# EAGLE board max10adc_v9.0_16chan_frontendtest2 (EAGLE 9.5.2), part 1 of 3
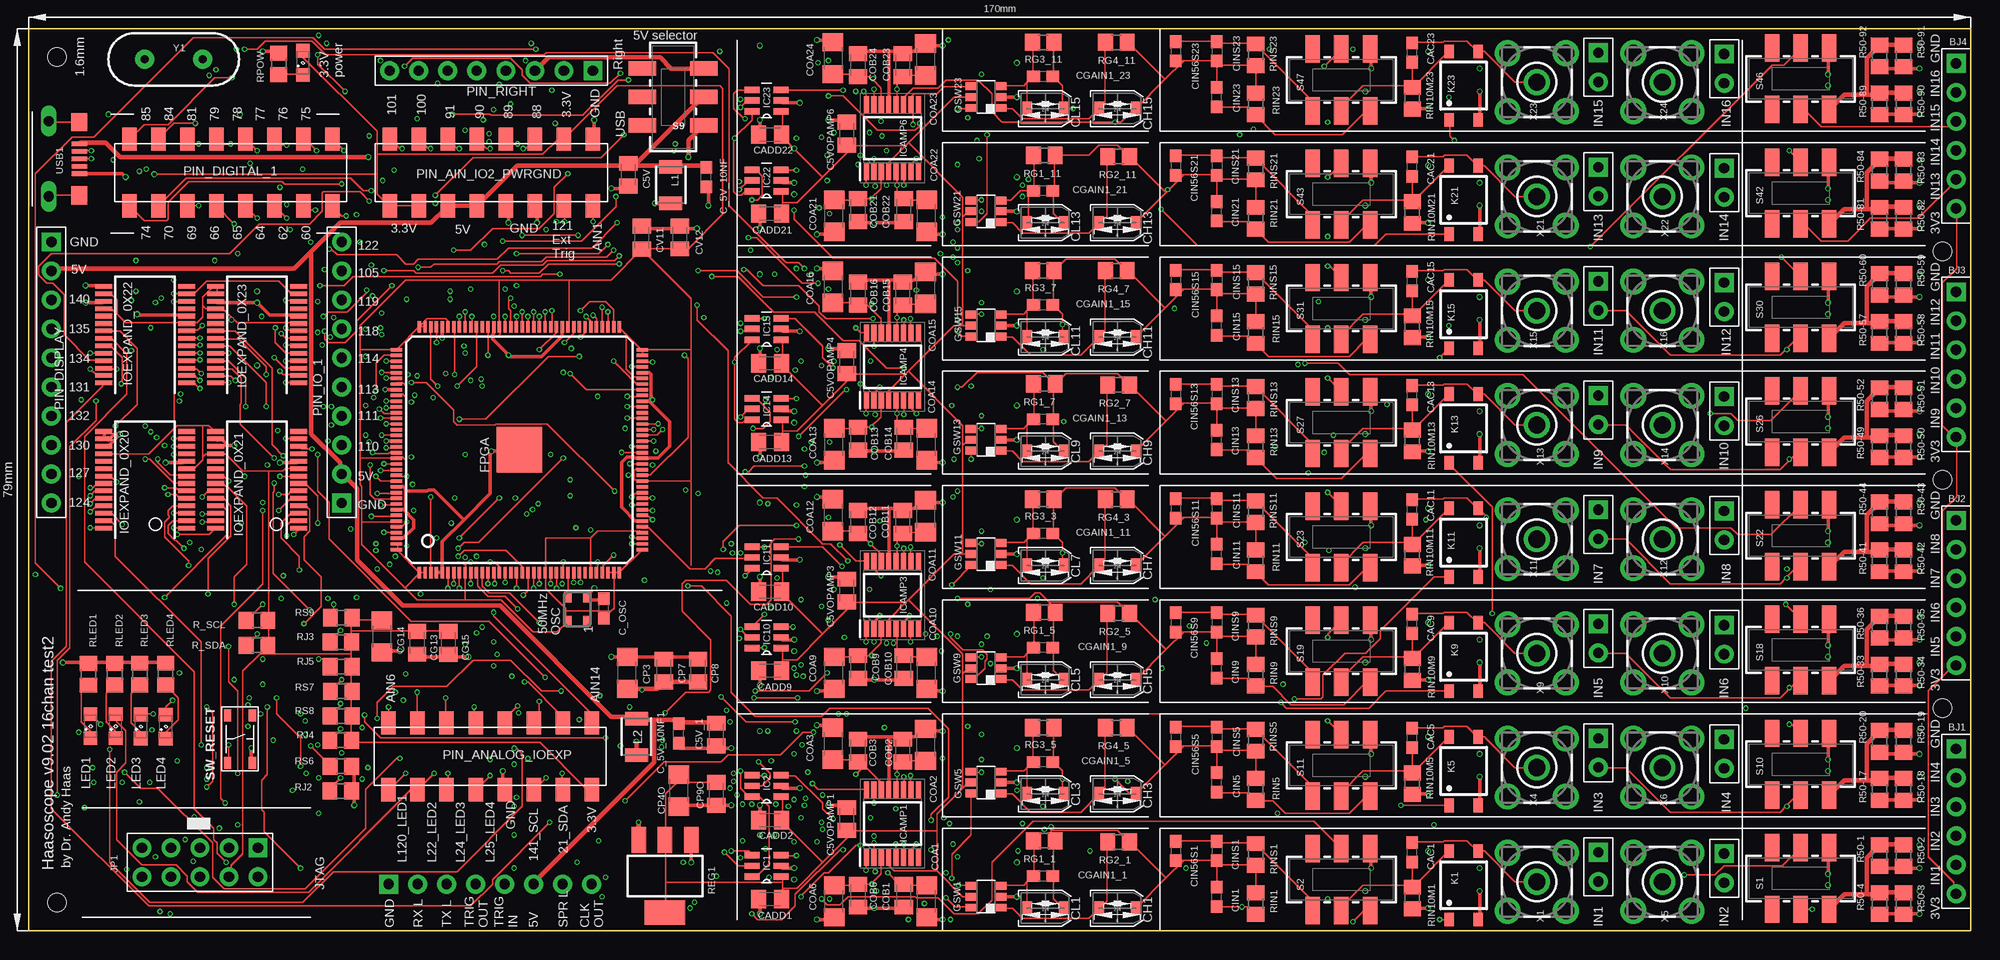
[diagram p6: board, top side]
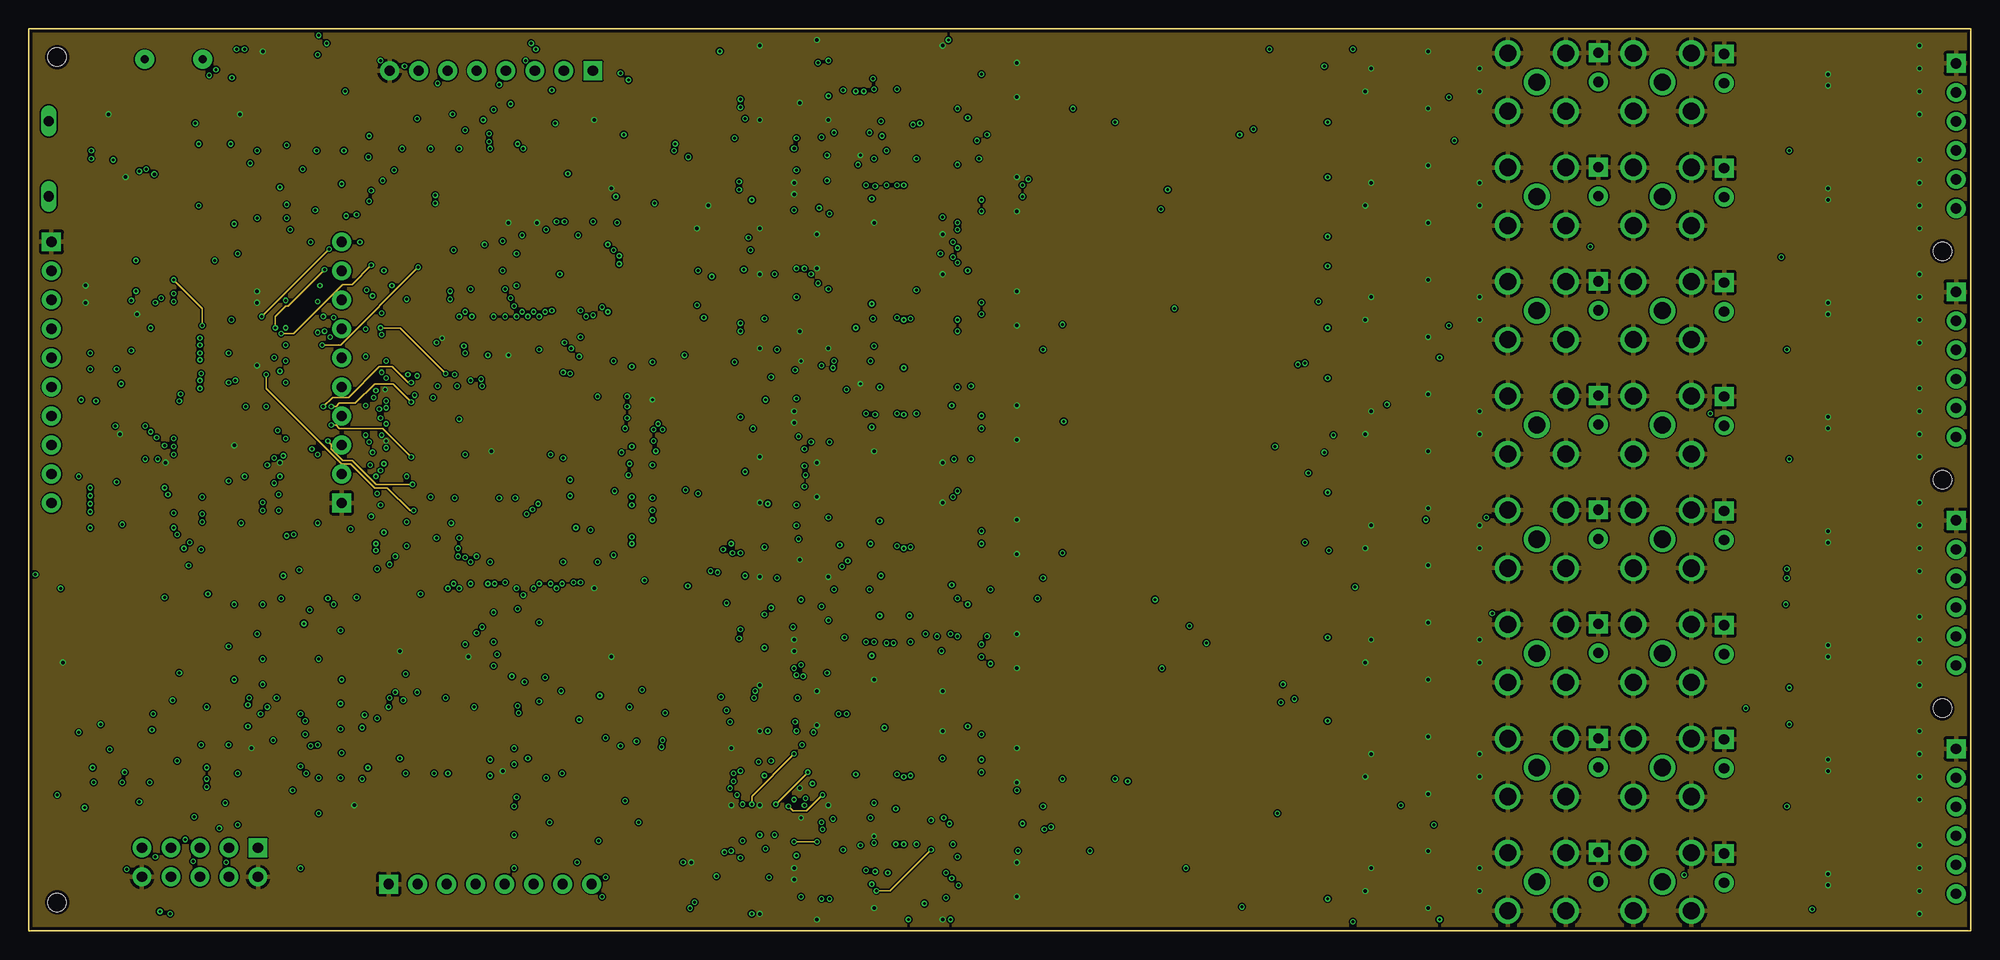
[diagram p7: board, inner layer Route2]
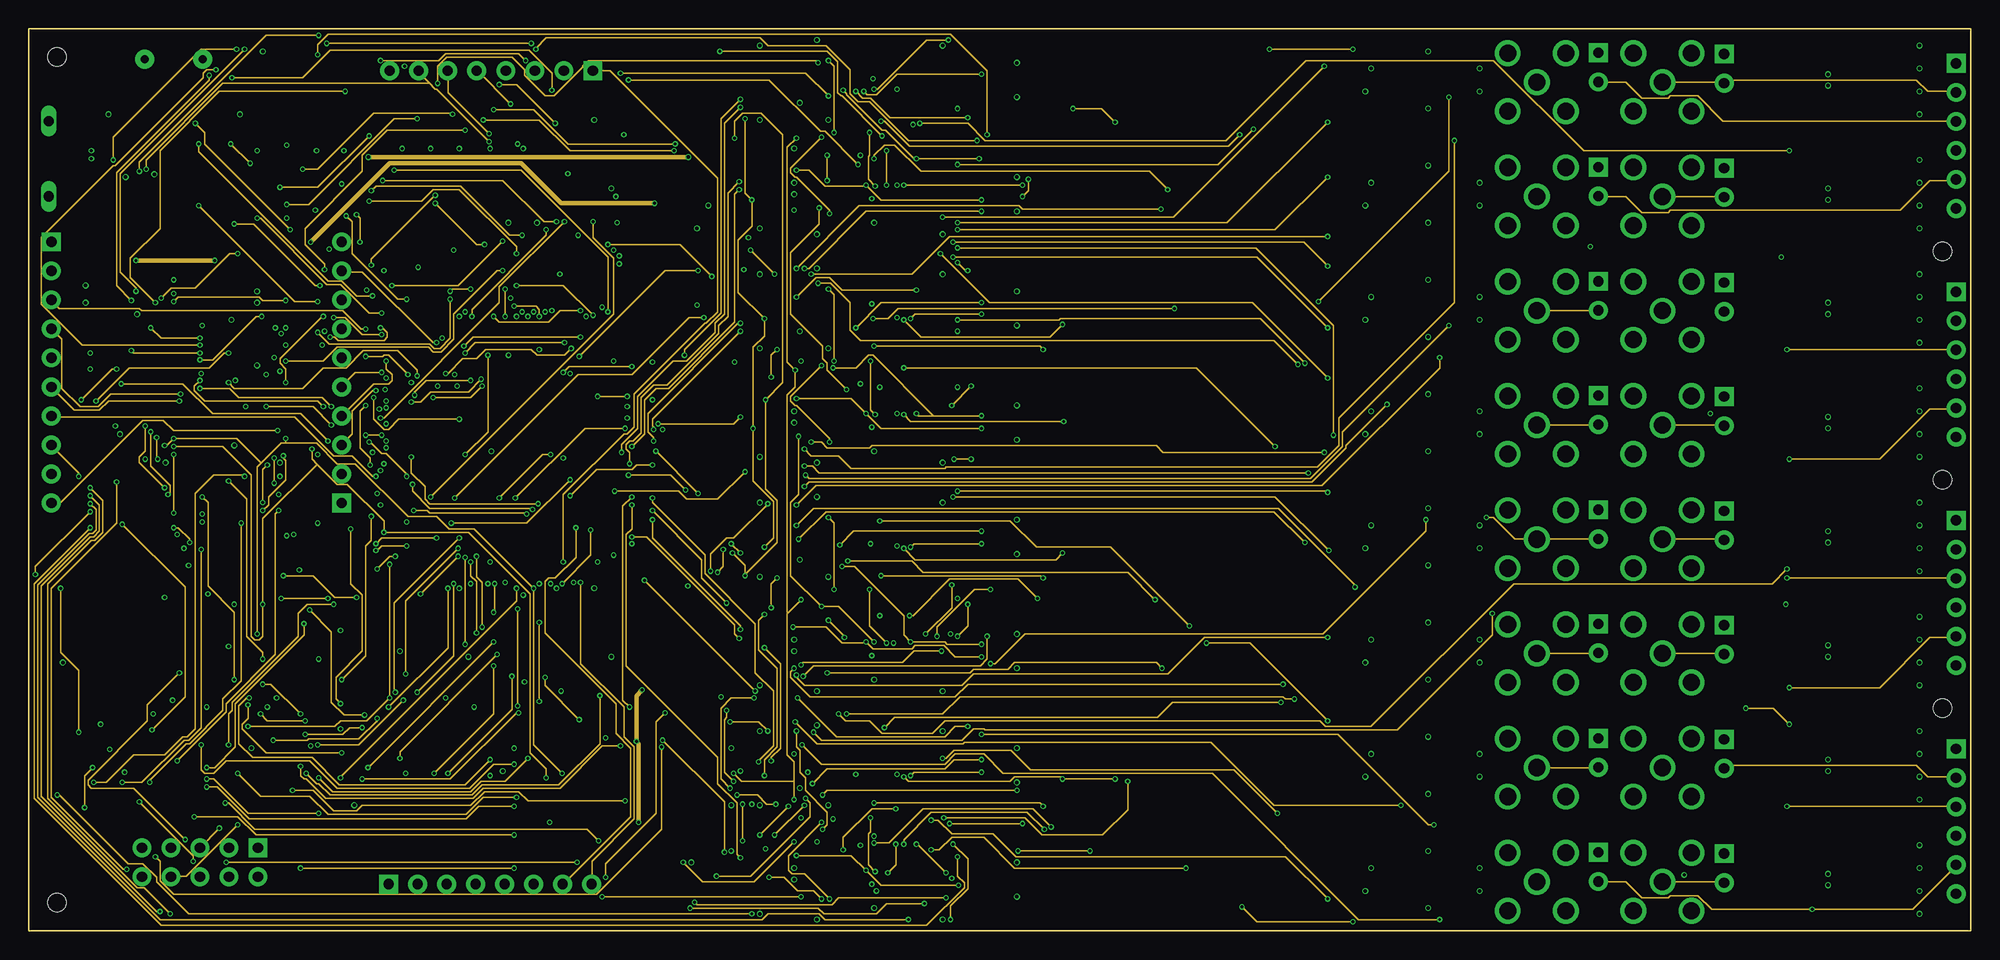
[diagram p8: board, inner layer Route15]
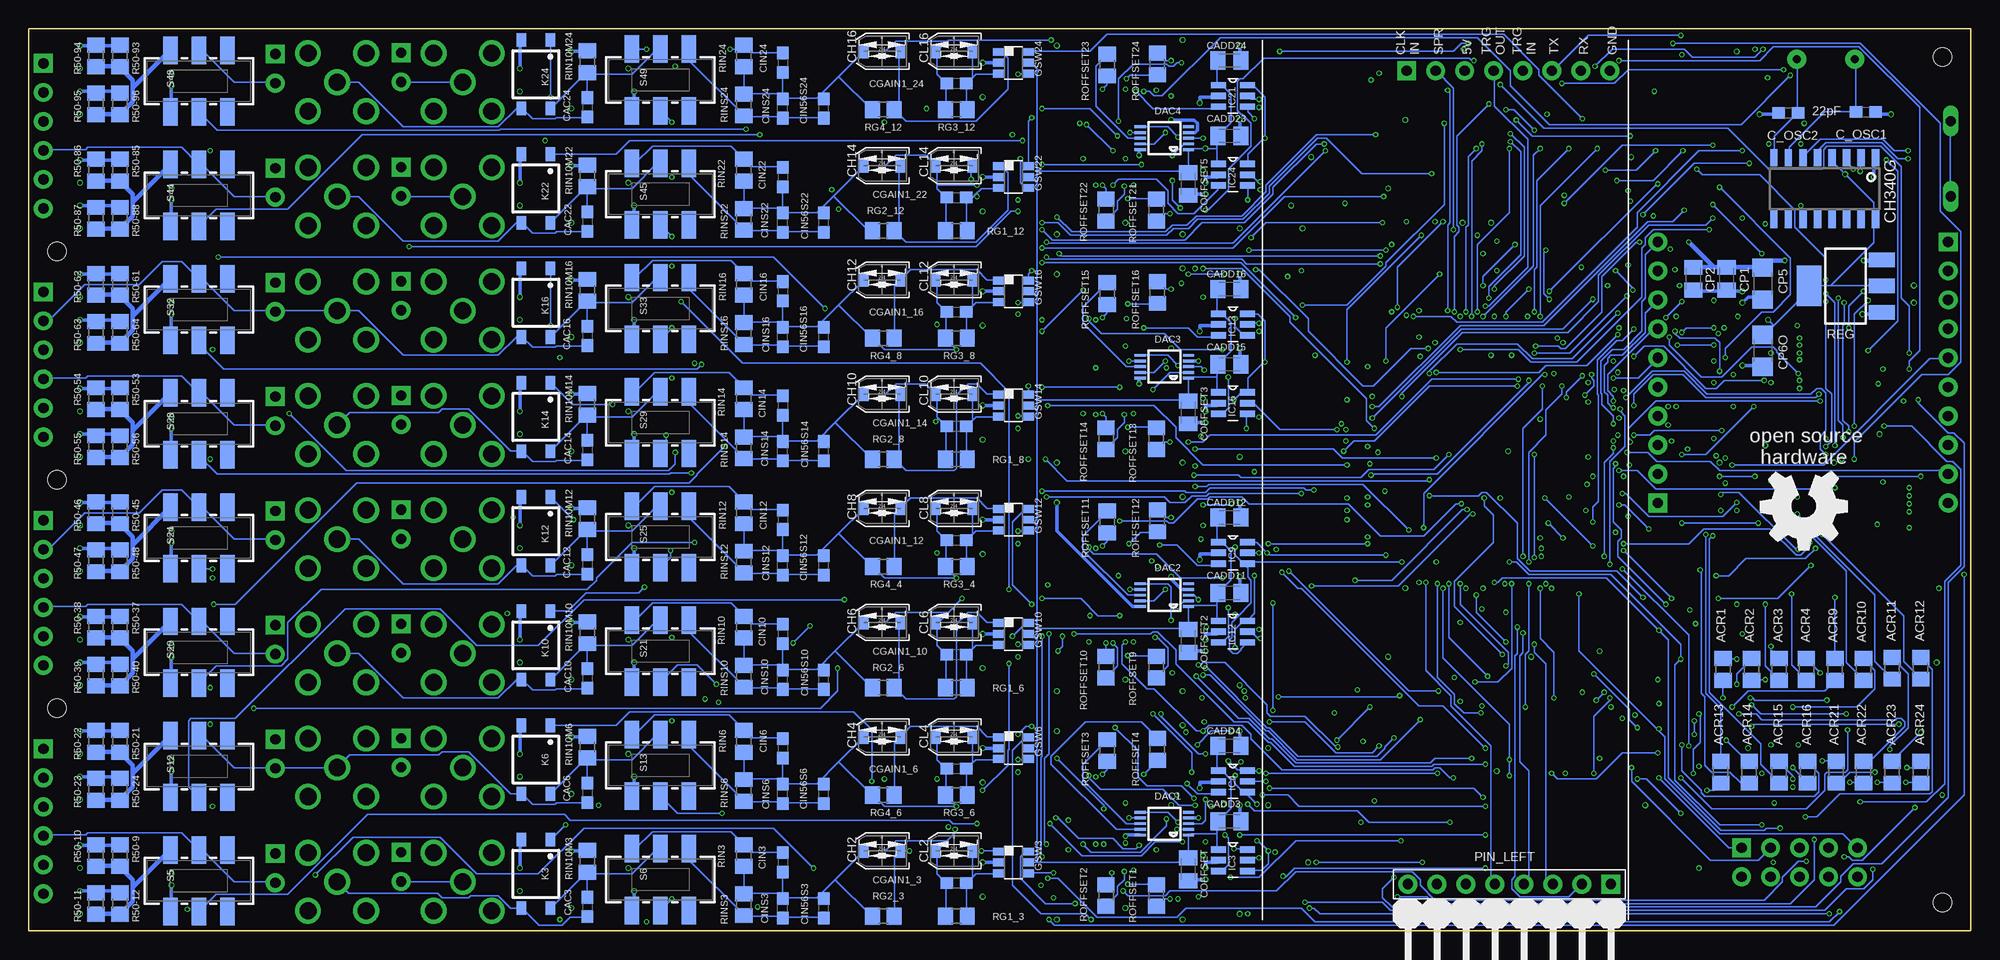
[diagram p9: board, bottom side, seen from below]

Size 170 x 79 mm. Coordinates in mm from the lower left corner, seen from the top.
Outline: 0,0 0,79 170,79 170,0 0,0
Copper layers (1*2*15*16): Top 0.035mm / dielectric 0.23mm / Route2 0.035mm / dielectric 0.93mm / Route15 0.035mm / dielectric 0.23mm / Bottom 0.035mm
Design rules "MF_Standard_4_Layer": minimum track width 5mil, minimum drill 10mil, track to track 5mil, track to pad 5mil, pad to pad 5mil, via to via 5mil, smd to smd 0mil, copper to edge 10mil, drill to drill 10mil, minimum pad ring 4mil, minimum via ring 4mil, stop-mask expansion 2mil, vias tented up to drill 25mil, thermal gap 10mil
Net classes: 0 default: width 0.152 mm; 1 gnd: width 0.305 mm; 2 three: width 0.152 mm; 3 five: width 0.381 mm
Holes 1.6 mm at 2.5,76.5 2.5,2.5 167.5,19.5 167.5,59.5 167.5,39.5

## Footprints (pad centres in the part's own frame; a part is rotated, then mirrored left to right if it is on the bottom)
R0805 = smd 1.3 x 1.5: 1 -0.95,0; 2 0.95,0
H6-2.54 = drill 0.889 pad 1.651 square: 1 0,6.35 | drill 0.889 pad 1.651: 2 0,3.81; 3 0,1.27; 4 0,-1.27; 5 0,-3.81; 6 0,-6.35
C0805K = smd 1.3 x 1.6: 1 -1,0; 2 1,0
C0603 = smd 1.1 x 1: 1 -0.85,0; 2 0.85,0
C1206 = smd 1.6 x 1.8: 1 -1.4,0; 2 1.4,0
CTZ3 = smd 1.2 x 0.8: + 0,1.598; - 0,-1.588
MSOP10 = smd 0.25 x 1: 1 -1,-2.113; 2 -0.5,-2.113; 3 0,-2.113; 4 0.5,-2.113; 5 1,-2.113; 6 1,2.113; 7 0.5,2.113; 8 0,2.113; 9 -0.5,2.113; 10 -1,2.113
EQFP144 = smd 1 x 0.3: 1 -10.75,8.75; 2 -10.75,8.25; 3 -10.75,7.75; 4 -10.75,7.25; 5 -10.75,6.75; 6 -10.75,6.25; 7 -10.75,5.75; 8 -10.75,5.25; 9 -10.75,4.75; 10 -10.75,4.25; 11 -10.75,3.75; 12 -10.75,3.25; 13 -10.75,2.75; 14 -10.75,2.25; 15 -10.75,1.75; 16 -10.75,1.25; 17 -10.75,0.75; 18 -10.75,0.25; 19 -10.75,-0.25; 20 -10.75,-0.75; 21 -10.75,-1.25; 22 -10.75,-1.75; 23 -10.75,-2.25; 24 -10.75,-2.75; 25 -10.75,-3.25; 26 -10.75,-3.75; 27 -10.75,-4.25; 28 -10.75,-4.75; 29 -10.75,-5.25; 30 -10.75,-5.75; 31 -10.75,-6.25; 32 -10.75,-6.75; 33 -10.75,-7.25; 34 -10.75,-7.75; 35 -10.75,-8.25; 36 -10.75,-8.75; 73 10.75,-8.75; 74 10.75,-8.25; 75 10.75,-7.75; 76 10.75,-7.25; 77 10.75,-6.75; 78 10.75,-6.25; 79 10.75,-5.75; 80 10.75,-5.25; 81 10.75,-4.75; 82 10.75,-4.25; 83 10.75,-3.75; 84 10.75,-3.25; 85 10.75,-2.75; 86 10.75,-2.25; 87 10.75,-1.75; 88 10.75,-1.25; 89 10.75,-0.75; 90 10.75,-0.25; 91 10.75,0.25; 92 10.75,0.75; 93 10.75,1.25; 94 10.75,1.75; 95 10.75,2.25; 96 10.75,2.75; 97 10.75,3.25; 98 10.75,3.75; 99 10.75,4.25; 100 10.75,4.75; 101 10.75,5.25; 102 10.75,5.75; 103 10.75,6.25; 104 10.75,6.75; 105 10.75,7.25; 106 10.75,7.75; 107 10.75,8.25; 108 10.75,8.75 | smd 0.3 x 1: 37 -8.75,-10.75; 38 -8.25,-10.75; 39 -7.75,-10.75; 40 -7.25,-10.75; 41 -6.75,-10.75; 42 -6.25,-10.75; 43 -5.75,-10.75; 44 -5.25,-10.75; 45 -4.75,-10.75; 46 -4.25,-10.75; 47 -3.75,-10.75; 48 -3.25,-10.75; 49 -2.75,-10.75; 50 -2.25,-10.75; 51 -1.75,-10.75; 52 -1.25,-10.75; 53 -0.75,-10.75; 54 -0.25,-10.75; 55 0.25,-10.75; 56 0.75,-10.75; 57 1.25,-10.75; 58 1.75,-10.75; 59 2.25,-10.75; 60 2.75,-10.75; 61 3.25,-10.75; 62 3.75,-10.75; 63 4.25,-10.75; 64 4.75,-10.75; 65 5.25,-10.75; 66 5.75,-10.75; 67 6.25,-10.75; 68 6.75,-10.75; 69 7.25,-10.75; 70 7.75,-10.75; 71 8.25,-10.75; 72 8.75,-10.75; 109 8.75,10.75; 110 8.25,10.75; 111 7.75,10.75; 112 7.25,10.75; 113 6.75,10.75; 114 6.25,10.75; 115 5.75,10.75; 116 5.25,10.75; 117 4.75,10.75; 118 4.25,10.75; 119 3.75,10.75; 120 3.25,10.75; 121 2.75,10.75; 122 2.25,10.75; 123 1.75,10.75; 124 1.25,10.75; 125 0.75,10.75; 126 0.25,10.75; 127 -0.25,10.75; 128 -0.75,10.75; 129 -1.25,10.75; 130 -1.75,10.75; 131 -2.25,10.75; 132 -2.75,10.75; 133 -3.25,10.75; 134 -3.75,10.75; 135 -4.25,10.75; 136 -4.75,10.75; 137 -5.25,10.75; 138 -5.75,10.75; 139 -6.25,10.75; 140 -6.75,10.75; 141 -7.25,10.75; 142 -7.75,10.75; 143 -8.25,10.75; 144 -8.75,10.75 | smd 4 x 4: E 0,0
DBV_R-PDSO-G6 = smd 0.69 x 0.99: 1 -0.95,-1.29; 2 0,-1.29; 3 0.95,-1.29; 4 0.95,1.3; 5 0,1.3; 6 -0.95,1.3
SOT95P280X145-6N = smd 1.321 x 0.559: 1 -1.27,0.94; 2 -1.27,0; 3 -1.27,-0.94; 4 1.27,-0.94; 5 1.27,0; 6 1.27,0.94
SOP65P640X120-16N = smd 1.475 x 0.45: 1 -2.938,2.275; 2 -2.938,1.625; 3 -2.938,0.975; 4 -2.938,0.325; 5 -2.938,-0.325; 6 -2.938,-0.975; 7 -2.938,-1.625; 8 -2.938,-2.275; 9 2.938,-2.275; 10 2.938,-1.625; 11 2.938,-0.975; 12 2.938,-0.325; 13 2.938,0.325; 14 2.938,0.975; 15 2.938,1.625; 16 2.938,2.275
H2-2.54 = drill 0.889 pad 1.651 square: 1 0,1.27 | drill 0.889 pad 1.651: 2 0,-1.27
SSOP28 = smd 0.4 x 1.5: 1 -4.225,-3.625; 2 -3.575,-3.625; 3 -2.925,-3.625; 4 -2.275,-3.625; 5 -1.625,-3.625; 6 -0.975,-3.625; 7 -0.325,-3.625; 8 0.325,-3.625; 9 0.975,-3.625; 10 1.625,-3.625; 11 2.275,-3.625; 12 2.925,-3.625; 13 3.575,-3.625; 14 4.225,-3.625; 15 4.225,3.625; 16 3.575,3.625; 17 2.925,3.625; 18 2.275,3.625; 19 1.625,3.625; 20 0.975,3.625; 21 0.325,3.625; 22 -0.325,3.625; 23 -0.975,3.625; 24 -1.625,3.625; 25 -2.275,3.625; 26 -2.925,3.625; 27 -3.575,3.625; 28 -4.225,3.625
H2X5-2.54 = drill 0.889 pad 1.651 square: 1 -1.27,5.08 | drill 0.889 pad 1.651: 2 -1.27,2.54; 3 -1.27,0; 4 -1.27,-2.54; 5 -1.27,-5.08; 6 1.27,-5.08; 7 1.27,-2.54; 8 1.27,0; 9 1.27,2.54; 10 1.27,5.08
SOP04 = smd 0.8 x 1.2: 1 -1.27,-3; 2 1.27,-3; 3 1.27,3; 4 -1.27,3
1210 = smd 1.2 x 2: 1 -1.6,0; 2 1.6,0
SML0805 = smd 1.2 x 1.2: A 1.05,0; C -1.05,0
ASE = smd 0.9 x 0.65: 1 -1.05,-0.825; 2 1.05,-0.825; 3 1.05,0.825; 4 -1.05,0.825
2X08_SMT = smd 1.27 x 2.032: 1 -8.89,-2.921; 2 -8.89,2.921; 3 -6.35,-2.921; 4 -6.35,2.921; 5 -3.81,-2.921; 6 -3.81,2.921; 7 -1.27,-2.921; 8 -1.27,2.921; 9 1.27,-2.921; 10 1.27,2.921; 11 3.81,-2.921; 12 3.81,2.921; 13 6.35,-2.921; 14 6.35,2.921; 15 8.89,-2.921; 16 8.89,2.921
H10-2.54 = drill 0.889 pad 1.651 square: 1 0,11.43 | drill 0.889 pad 1.651: 2 0,8.89; 3 0,6.35; 4 0,3.81; 5 0,1.27; 6 0,-1.27; 7 0,-3.81; 8 0,-6.35; 9 0,-8.89; 10 0,-11.43
H8-2.54-90D-MALE = drill 0.889 pad 1.651 square: 1 0,8.89 | drill 0.889 pad 1.651: 2 0,6.35; 3 0,3.81; 4 0,1.27; 5 0,-1.27; 6 0,-3.81; 7 0,-6.35; 8 0,-8.89
H8-2.54-90D-FEMALE = drill 0.889 pad 1.651 square: 1 0,8.89 | drill 0.889 pad 1.651: 2 0,6.35; 3 0,3.81; 4 0,1.27; 5 0,-1.27; 6 0,-3.81; 7 0,-6.35; 8 0,-8.89
SOT-223 = smd 1.27 x 2.286: 1 -2.286,-3.175; 2 0,-3.175; 3 2.286,-3.175 | smd 3.556 x 2.159: TER 0,3.175
JS202011SCQN = smd 1.27 x 2.4: 1 -2.5,-2.7; 2 0,-2.7; 3 2.5,-2.7; 4 -2.5,2.7; 5 0,2.7; 6 2.5,2.7
TACT4.2MM = smd 1.05 x 0.65: P$1 -2.075,1.075; P$2 2.075,1.075; P$3 -2.075,-1.075; P$4 2.075,-1.075
SOIC16 = smd 0.635 x 1.524: 1 -4.445,-2.695; 2 -3.175,-2.695; 3 -1.905,-2.695; 4 -0.635,-2.695; 5 0.635,-2.695; 6 1.905,-2.695; 7 3.175,-2.695; 8 4.445,-2.695; 9 4.445,2.695; 10 3.175,2.695; 11 1.905,2.695; 12 0.635,2.695; 13 -0.635,2.695; 14 -1.905,2.695; 15 -3.175,2.695; 16 -4.445,2.695
10118193-0001LF = smd 0.4 x 1.35: 1 -1.3,2.54; 2 -0.65,2.54; 3 0,2.54; 4 0.65,2.54; 5 1.3,2.54 | drill 0.9 long: S1 -3.3,-0.135; S2 3.3,-0.135 | smd 1.6 x 1.4: S3 -3.2,2.54; S4 3.2,2.54
LTI-SASF54GT = drill 1.5 pad 2.2: 1 0,0; 2 -2.54,2.54; 3 2.54,2.54; 4 2.54,-2.54; 5 -2.54,-2.54
HC49US = drill 0.7 pad 1.651: 1 -2.54,0; 2 2.54,0

## Placement (x,y rotation side)
ACR1  560  [R0805]  21.7,22.9 270 bottom
ACR2  560  [R0805]  19.2,22.9 90 bottom
ACR3  560  [R0805]  16.8,22.9 90 bottom
ACR4  560  [R0805]  14.4,22.9 90 bottom
ACR9  560  [R0805]  11.9,22.9 270 bottom
ACR10  560  [R0805]  9.4,22.9 90 bottom
ACR11  560  [R0805]  6.9,23 90 bottom
ACR12  560  [R0805]  4.4,23 90 bottom
ACR13  560  [R0805]  21.9,13.9 270 bottom
ACR14  560  [R0805]  19.4,13.9 90 bottom
ACR15  560  [R0805]  16.8,13.9 90 bottom
ACR16  560  [R0805]  14.3,13.9 90 bottom
ACR21  560  [R0805]  11.8,13.9 270 bottom
ACR22  560  [R0805]  9.4,13.9 90 bottom
ACR23  560  [R0805]  6.9,13.9 90 bottom
ACR24  560  [R0805]  4.4,13.9 90 bottom
BJ1  6p-2.54  [H6-2.54]  168.7,9.6 0 top
BJ2  6p-2.54  [H6-2.54]  168.7,29.6 0 top
BJ3  6p-2.54  [H6-2.54]  168.7,49.6 0 top
BJ4  6p-2.54  [H6-2.54]  168.7,69.6 0 top
C5V  1uF  [C0805K]  52.5,66.2 90 top
C5V_1  1uF  [C0805K]  60.2,17.2 90 top
C5VOPAMP1  0.1uF  [C0805K]  71.6,9.8 90 top
C5VOPAMP3  0.1uF  [C0805K]  71.6,29.8 90 top
C5VOPAMP4  0.1uF  [C0805K]  71.6,49.8 90 top
C5VOPAMP6  0.1uF  [C0805K]  71.6,69.8 90 top
C_5V_10NF  0.01uF  [C0603]  59.3,66 90 top
C_5V_10NF1  0.01uF  [C0603]  56.9,17.3 90 top
C_OSC  0.01uF  [C0603]  50.36,28.22 90 top
C_OSC1  22pF  [C0603]  9.2,71.7 0 bottom
C_OSC2  22pF  [C0603]  16,71.6 180 bottom
CAC1  0.01uF  [C0603]  121.1,6.9 90 top
CAC3  0.01uF  [C0603]  121.1,2.1 270 bottom
CAC5  0.01uF  [C0603]  121.1,16.9 90 top
CAC6  0.01uF  [C0603]  121.1,12.1 270 bottom
CAC9  0.01uF  [C0603]  121.1,26.9 90 top
CAC10  0.01uF  [C0603]  121.1,22.1 270 bottom
CAC11  0.01uF  [C0603]  121.1,36.9 90 top
CAC12  0.01uF  [C0603]  121.1,32.1 270 bottom
CAC13  0.01uF  [C0603]  121.1,46.9 90 top
CAC14  0.01uF  [C0603]  121.1,42.1 270 bottom
CAC15  0.01uF  [C0603]  121.1,56.9 90 top
CAC16  0.01uF  [C0603]  121.1,52.1 270 bottom
CAC21  0.01uF  [C0603]  121.1,66.9 90 top
CAC22  0.01uF  [C0603]  121.1,62.1 270 bottom
CAC23  0.01uF  [C0603]  121.1,76.9 90 top
CAC24  0.01uF  [C0603]  121.1,72.1 270 bottom
CADD1  0.1uF  [C0805K]  64.9,2.8 180 top
CADD2  0.1uF  [C0805K]  64.9,9.7 180 top
CADD3  0.1uF  [C0805K]  64.9,9.6 0 bottom
CADD4  0.1uF  [C0805K]  64.9,16.2 0 bottom
CADD9  0.1uF  [C0805K]  64.9,22.8 180 top
CADD10  0.1uF  [C0805K]  64.9,29.7 180 top
CADD11  0.1uF  [C0805K]  64.9,29.6 0 bottom
CADD12  0.1uF  [C0805K]  64.9,36.2 0 bottom
CADD13  0.1uF  [C0805K]  64.9,42.8 180 top
CADD14  0.1uF  [C0805K]  64.9,49.7 180 top
CADD15  0.1uF  [C0805K]  64.9,49.6 0 bottom
CADD16  0.1uF  [C0805K]  64.9,56.2 0 bottom
CADD21  0.1uF  [C0805K]  64.9,62.8 180 top
CADD22  0.1uF  [C0805K]  64.9,69.7 180 top
CADD23  0.1uF  [C0805K]  64.9,69.6 0 bottom
CADD24  0.1uF  [C0805K]  64.9,76.2 0 bottom
CG13  1uF  [C0805K]  34.01,25.23 270 top
CG14  10uF  [C1206]  30.91,25.79 270 top
CG15  0.1uF  [C0805K]  36.75,25.21 270 top
CGAIN1_1  220pF  [C0603]  88.8,4.8 180 top
CGAIN1_3  220pF  [C0603]  88.8,4.2 0 bottom
CGAIN1_5  220pF  [C0603]  88.8,14.8 180 top
CGAIN1_6  220pF  [C0603]  88.8,14.2 0 bottom
CGAIN1_9  220pF  [C0603]  88.8,24.8 180 top
CGAIN1_10  220pF  [C0603]  88.8,24.2 0 bottom
CGAIN1_11  220pF  [C0603]  88.8,34.8 180 top
CGAIN1_12  220pF  [C0603]  88.8,34.2 0 bottom
CGAIN1_13  220pF  [C0603]  88.8,44.8 180 top
CGAIN1_14  220pF  [C0603]  88.8,44.2 0 bottom
CGAIN1_15  220pF  [C0603]  88.8,54.8 180 top
CGAIN1_16  220pF  [C0603]  88.8,54.2 0 bottom
CGAIN1_21  220pF  [C0603]  88.8,64.8 180 top
CGAIN1_22  220pF  [C0603]  88.8,64.2 0 bottom
CGAIN1_23  220pF  [C0603]  88.8,74.8 180 top
CGAIN1_24  220pF  [C0603]  88.8,74.2 0 bottom
CH1  8-45pF  [CTZ3]  95.3,2 270 top
CH2  8-45pF  [CTZ3]  95.3,7 90 bottom
CH3  8-45pF  [CTZ3]  95.3,12 270 top
CH4  8-45pF  [CTZ3]  95.3,17 90 bottom
CH5  8-45pF  [CTZ3]  95.3,22 270 top
CH6  8-45pF  [CTZ3]  95.3,27 90 bottom
CH7  8-45pF  [CTZ3]  95.3,32 270 top
CH8  8-45pF  [CTZ3]  95.3,37 90 bottom
CH9  8-45pF  [CTZ3]  95.3,42 270 top
CH10  8-45pF  [CTZ3]  95.3,47 90 bottom
CH11  8-45pF  [CTZ3]  95.3,52 270 top
CH12  8-45pF  [CTZ3]  95.3,57 90 bottom
CH13  8-45pF  [CTZ3]  95.3,62 270 top
CH14  8-45pF  [CTZ3]  95.3,67 90 bottom
CH15  8-45pF  [CTZ3]  95.3,72 270 top
CH16  8-45pF  [CTZ3]  95.3,77 90 bottom
CIN1  10pF  [C0603]  104,3 90 top
CIN3  10pF  [C0603]  104,6 270 bottom
CIN5  10pF  [C0603]  104,13 90 top
CIN6  10pF  [C0603]  104,16 270 bottom
CIN9  10pF  [C0603]  104,23 90 top
CIN10  10pF  [C0603]  104,26 270 bottom
CIN11  10pF  [C0603]  104,33 90 top
CIN12  10pF  [C0603]  104,36 270 bottom
CIN13  10pF  [C0603]  104,43 90 top
CIN14  10pF  [C0603]  104,46 270 bottom
CIN15  10pF  [C0603]  104,53 90 top
CIN16  10pF  [C0603]  104,56 270 bottom
CIN21  10pF  [C0603]  104,63 90 top
CIN22  10pF  [C0603]  104,66 270 bottom
CIN23  10pF  [C0603]  104,73 90 top
CIN24  10pF  [C0603]  104,76 270 bottom
CIN56S1  56pF  [C0603]  100.4,7 270 top
CIN56S3  56pF  [C0603]  100.4,2 90 bottom
CIN56S5  56pF  [C0603]  100.4,17 270 top
CIN56S6  56pF  [C0603]  100.4,12 90 bottom
CIN56S9  56pF  [C0603]  100.4,27 270 top
CIN56S10  56pF  [C0603]  100.4,22 90 bottom
CIN56S11  56pF  [C0603]  100.4,37 270 top
CIN56S12  56pF  [C0603]  100.4,32 90 bottom
CIN56S13  56pF  [C0603]  100.4,47 270 top
CIN56S14  56pF  [C0603]  100.4,42 90 bottom
CIN56S15  56pF  [C0603]  100.4,57 270 top
CIN56S16  56pF  [C0603]  100.4,52 90 bottom
CIN56S21  56pF  [C0603]  100.4,67 270 top
CIN56S22  56pF  [C0603]  100.4,62 90 bottom
CIN56S23  56pF  [C0603]  100.4,77 270 top
CIN56S24  56pF  [C0603]  100.4,72 90 bottom
CINS1  1nF  [C0603]  104,7 270 top
CINS3  1nF  [C0603]  104,2 90 bottom
CINS5  1nF  [C0603]  104,17 270 top
CINS6  1nF  [C0603]  104,12 90 bottom
CINS9  1nF  [C0603]  104,27 270 top
CINS10  1nF  [C0603]  104,22 90 bottom
CINS11  1nF  [C0603]  104,37 270 top
CINS12  1nF  [C0603]  104,32 90 bottom
CINS13  1nF  [C0603]  104,47 270 top
CINS14  1nF  [C0603]  104,42 90 bottom
CINS15  1nF  [C0603]  104,57 270 top
CINS16  1nF  [C0603]  104,52 90 bottom
CINS21  1nF  [C0603]  104,67 270 top
CINS22  1nF  [C0603]  104,62 90 bottom
CINS23  1nF  [C0603]  104,77 270 top
CINS24  1nF  [C0603]  104,72 90 bottom
CL1  8-45pF  [CTZ3]  89,2 270 top
CL2  8-45pF  [CTZ3]  89,7 90 bottom
CL3  8-45pF  [CTZ3]  89,12 270 top
CL4  8-45pF  [CTZ3]  89,17 90 bottom
CL5  8-45pF  [CTZ3]  89,22 270 top
CL6  8-45pF  [CTZ3]  89,27 90 bottom
CL7  8-45pF  [CTZ3]  89,32 270 top
CL8  8-45pF  [CTZ3]  89,37 90 bottom
CL9  8-45pF  [CTZ3]  89,42 270 top
CL10  8-45pF  [CTZ3]  89,47 90 bottom
CL11  8-45pF  [CTZ3]  89,52 270 top
CL12  8-45pF  [CTZ3]  89,57 90 bottom
CL13  8-45pF  [CTZ3]  89,62 270 top
CL14  8-45pF  [CTZ3]  89,67 90 bottom
CL15  8-45pF  [CTZ3]  89,72 270 top
CL16  8-45pF  [CTZ3]  89,77 90 bottom
COA1  10uF  [C1206]  78.6,2.6 90 top
COA2  10uF  [C1206]  78.5,16.3 270 top
COA3  10uF  [C1206]  70.4,16.4 270 top
COA6  10uF  [C1206]  70.5,2.6 90 top
COA9  10uF  [C1206]  70.5,22.6 90 top
COA10  10uF  [C1206]  78.6,22.6 90 top
COA11  10uF  [C1206]  78.5,36.3 270 top
COA12  10uF  [C1206]  70.4,36.4 270 top
COA13  10uF  [C1206]  70.5,42.6 90 top
COA14  10uF  [C1206]  78.6,42.6 90 top
COA15  10uF  [C1206]  78.5,56.3 270 top
COA16  10uF  [C1206]  70.4,56.4 270 top
COA21  10uF  [C1206]  70.5,62.6 90 top
COA22  10uF  [C1206]  78.6,62.6 90 top
COA23  10uF  [C1206]  78.5,76.3 270 top
COA24  10uF  [C1206]  70.4,76.4 270 top
COB1  0.1uF  [C0805K]  76.6,3.1 90 top
COB2  0.1uF  [C0805K]  76.5,15.8 270 top
COB3  0.1uF  [C0805K]  72.6,15.8 270 top
COB6  0.1uF  [C0805K]  72.6,3.1 90 top
COB9  0.1uF  [C0805K]  72.6,23.1 90 top
COB10  0.1uF  [C0805K]  76.6,23.1 90 top
COB11  0.1uF  [C0805K]  76.5,35.8 270 top
COB12  0.1uF  [C0805K]  72.6,35.8 270 top
COB13  0.1uF  [C0805K]  72.6,43.1 90 top
COB14  0.1uF  [C0805K]  76.6,43.1 90 top
COB15  0.1uF  [C0805K]  76.5,55.8 270 top
COB16  0.1uF  [C0805K]  72.6,55.8 270 top
COB21  0.1uF  [C0805K]  72.6,63.1 90 top
COB22  0.1uF  [C0805K]  76.6,63.1 90 top
COB23  0.1uF  [C0805K]  76.5,75.8 270 top
COB24  0.1uF  [C0805K]  72.6,75.8 270 top
COFFSET  0.1uF  [C0805K]  68.5,5.4 90 bottom
COFFSET2  0.1uF  [C0805K]  68.5,25.4 90 bottom
COFFSET3  0.1uF  [C0805K]  68.5,45.4 90 bottom
COFFSET5  0.1uF  [C0805K]  68.5,65.4 90 bottom
CP1  1uF  [C0805K]  21.4,57.1 270 bottom
CP2  0.1uF  [C0805K]  24.3,57.1 270 bottom
CP3  10uF  [C1206]  52.4,22.6 90 top
CP4O  10uF  [C1206]  56.9,12.3 270 top
CP5  10uF  [C1206]  18.22,56.67 270 bottom
CP6O  10uF  [C1206]  18.22,50.8 270 bottom
CP7  1uF  [C0805K]  55.6,22.8 90 top
CP8  0.1uF  [C0805K]  58.6,22.8 90 top
CP9O  1uF  [C0805K]  60.2,12 270 top
CV11  0.1uF  [C0805K]  53.67,60.69 90 top
CV12  1uF  [C0805K]  57.01,60.71 90 top
DAC1  MCP4728  [MSOP10]  70.6,9.4 90 bottom
DAC2  MCP4728  [MSOP10]  70.6,29.4 90 bottom
DAC3  MCP4728  [MSOP10]  70.6,49.4 90 bottom
DAC4  MCP4728  [MSOP10]  70.6,69.4 90 bottom
FPGA  10M08SAE144  [EQFP144]  42.96,42.13 90 top
GOLD_ORB_SM1  OSHWLOGOLOGO8MM  [OSHW_8MM]  14.6,37.2 180 bottom
GSW1  741G3157DBVR  [DBV_R-PDSO-G6]  83.8,3 90 top
GSW3  741G3157DBVR  [DBV_R-PDSO-G6]  83.8,6 270 bottom
GSW5  741G3157DBVR  [DBV_R-PDSO-G6]  83.8,13 90 top
GSW6  741G3157DBVR  [DBV_R-PDSO-G6]  83.8,16 270 bottom
GSW9  741G3157DBVR  [DBV_R-PDSO-G6]  83.8,23 90 top
GSW10  741G3157DBVR  [DBV_R-PDSO-G6]  83.8,26 270 bottom
GSW11  741G3157DBVR  [DBV_R-PDSO-G6]  83.8,33 90 top
GSW12  741G3157DBVR  [DBV_R-PDSO-G6]  83.8,36 270 bottom
GSW13  741G3157DBVR  [DBV_R-PDSO-G6]  83.8,43 90 top
GSW14  741G3157DBVR  [DBV_R-PDSO-G6]  83.8,46 270 bottom
GSW15  741G3157DBVR  [DBV_R-PDSO-G6]  83.8,53 90 top
GSW16  741G3157DBVR  [DBV_R-PDSO-G6]  83.8,56 270 bottom
GSW21  741G3157DBVR  [DBV_R-PDSO-G6]  83.8,63 90 top
GSW22  741G3157DBVR  [DBV_R-PDSO-G6]  83.8,66 270 bottom
GSW23  741G3157DBVR  [DBV_R-PDSO-G6]  83.8,73 90 top
GSW24  741G3157DBVR  [DBV_R-PDSO-G6]  83.8,76 270 bottom
IC1  MAX11115AUT+T  [SOT95P280X145-6N]  64.6,5.7 180 top
IC2  MAX11115AUT+T  [SOT95P280X145-6N]  64.6,12.7 180 top
IC3  MAX11115AUT+T  [SOT95P280X145-6N]  64.6,6.2 0 bottom
IC4  MAX11115AUT+T  [SOT95P280X145-6N]  64.6,13.1 0 bottom
IC9  MAX11115AUT+T  [SOT95P280X145-6N]  64.6,33.1 0 bottom
IC10  MAX11115AUT+T  [SOT95P280X145-6N]  64.6,25.7 180 top
IC11  MAX11115AUT+T  [SOT95P280X145-6N]  64.6,32.7 180 top
IC12  MAX11115AUT+T  [SOT95P280X145-6N]  64.6,26.2 0 bottom
IC13  MAX11115AUT+T  [SOT95P280X145-6N]  64.6,53.1 0 bottom
IC14  MAX11115AUT+T  [SOT95P280X145-6N]  64.6,45.7 180 top
IC15  MAX11115AUT+T  [SOT95P280X145-6N]  64.6,52.7 180 top
IC16  MAX11115AUT+T  [SOT95P280X145-6N]  64.6,46.2 0 bottom
IC21  MAX11115AUT+T  [SOT95P280X145-6N]  64.6,73.1 0 bottom
IC22  MAX11115AUT+T  [SOT95P280X145-6N]  64.6,65.7 180 top
IC23  MAX11115AUT+T  [SOT95P280X145-6N]  64.6,72.7 180 top
IC24  MAX11115AUT+T  [SOT95P280X145-6N]  64.6,66.2 0 bottom
ICAMP1  OPA4322AIPWR  [SOP65P640X120-16N]  75.6,9.4 90 top
ICAMP3  OPA4322AIPWR  [SOP65P640X120-16N]  75.6,29.4 90 top
ICAMP4  OPA4322AIPWR  [SOP65P640X120-16N]  75.6,49.4 90 top
ICAMP6  OPA4322AIPWR  [SOP65P640X120-16N]  75.6,69.4 90 top
IN1  2p-2.54  [H2-2.54]  137.4,5.6 0 top
IN2  2p-2.54  [H2-2.54]  148.4,5.5 0 top
IN3  2p-2.54  [H2-2.54]  137.4,15.6 0 top
IN4  2p-2.54  [H2-2.54]  148.4,15.5 0 top
IN5  2p-2.54  [H2-2.54]  137.4,25.6 0 top
IN6  2p-2.54  [H2-2.54]  148.4,25.5 0 top
IN7  2p-2.54  [H2-2.54]  137.4,35.6 0 top
IN8  2p-2.54  [H2-2.54]  148.4,35.5 0 top
IN9  2p-2.54  [H2-2.54]  137.4,45.6 0 top
IN10  2p-2.54  [H2-2.54]  148.4,45.5 0 top
IN11  2p-2.54  [H2-2.54]  137.4,55.6 0 top
IN12  2p-2.54  [H2-2.54]  148.4,55.5 0 top
IN13  2p-2.54  [H2-2.54]  137.4,65.6 0 top
IN14  2p-2.54  [H2-2.54]  148.4,65.5 0 top
IN15  2p-2.54  [H2-2.54]  137.4,75.6 0 top
IN16  2p-2.54  [H2-2.54]  148.4,75.5 0 top
IOEXPAND_0X20  MCP23017SS  [SSOP28]  10.2,39.5 90 top
IOEXPAND_0X21  MCP23017SS  [SSOP28]  20,39.5 90 top
IOEXPAND_0X22  MCP23017SS  [SSOP28]  10.2,52.2 90 top
IOEXPAND_0X23  MCP23017SS  [SSOP28]  20,52.2 90 top
JP1  2x5p-2.54  [H2X5-2.54]  15,6 270 top
K1  AQY21SOP  [SOP04]  125.6,4 0 top
K3  AQY21SOP  [SOP04]  125.6,5 180 bottom
K5  AQY21SOP  [SOP04]  125.6,14 0 top
K6  AQY21SOP  [SOP04]  125.6,15 180 bottom
K9  AQY21SOP  [SOP04]  125.6,24 0 top
K10  AQY21SOP  [SOP04]  125.6,25 180 bottom
K11  AQY21SOP  [SOP04]  125.6,34 0 top
K12  AQY21SOP  [SOP04]  125.6,35 180 bottom
K13  AQY21SOP  [SOP04]  125.6,44 0 top
K14  AQY21SOP  [SOP04]  125.6,45 180 bottom
K15  AQY21SOP  [SOP04]  125.6,54 0 top
K16  AQY21SOP  [SOP04]  125.6,55 180 bottom
K21  AQY21SOP  [SOP04]  125.6,64 0 top
K22  AQY21SOP  [SOP04]  125.6,65 180 bottom
K23  AQY21SOP  [SOP04]  125.6,74 0 top
K24  AQY21SOP  [SOP04]  125.6,75 180 bottom
L1  10uH  [1210]  56.2,65.3 270 top
L2  10uH  [1210]  53.2,17 270 top
LED1  MF-LED-0805-RED  [SML0805]  5.42,17.93 90 top
LED2  MF-LED-0805-RED  [SML0805]  7.62,17.92 90 top
LED3  MF-LED-0805-RED  [SML0805]  9.82,17.91 90 top
LED4  MF-LED-0805-RED  [SML0805]  12,17.9 90 top
LEDPOW  MF-LED-0805-RED  [SML0805]  24,76 90 top
OSC  ASE-50.000MHZ-ET  [ASE]  48.04,28.16 90 top
PIN_AIN_IO2_PWRGND  15-91-2160  [2X08_SMT]  40.5,66.4 180 top
PIN_ANALOG_IOEXP  15-91-2160  [2X08_SMT]  40.4,15.3 0 top
PIN_DIGITAL_1  15-91-2160  [2X08_SMT]  17.7,66.4 0 top
PIN_DISPLAY  YELLOW-10P-2.54  [H10-2.54]  2,48.9 0 top
PIN_IO_1  YELLOW-10P-2.54  [H10-2.54]  27.4,48.9 180 top
PIN_LEFT  8p-2.54-90d  [H8-2.54-90D-MALE]  40.4,4.1 270 bottom
PIN_RIGHT  8p-2.54-90d  [H8-2.54-90D-FEMALE]  40.5,75.3 270 top
R50-1  200R  [R0805]  162,6.6 270 top
R50-2  200R  [R0805]  164.1,6.6 270 top
R50-3  200R  [R0805]  164.1,2.4 270 top
R50-4  200R  [R0805]  162,2.4 270 top
R50-9  200R  [R0805]  162,6.6 90 bottom
R50-10  200R  [R0805]  164.1,6.6 90 bottom
R50-11  200R  [R0805]  164.1,2.4 90 bottom
R50-12  200R  [R0805]  162,2.4 90 bottom
R50-17  200R  [R0805]  162,12.4 270 top
R50-18  200R  [R0805]  164.1,12.4 270 top
R50-19  200R  [R0805]  164.1,16.6 270 top
R50-20  200R  [R0805]  162,16.6 270 top
R50-21  200R  [R0805]  162,16.6 90 bottom
R50-22  200R  [R0805]  164.1,16.6 90 bottom
R50-23  200R  [R0805]  164.1,12.4 90 bottom
R50-24  200R  [R0805]  162,12.4 90 bottom
R50-33  200R  [R0805]  162,22.4 270 top
R50-34  200R  [R0805]  164.1,22.4 270 top
R50-35  200R  [R0805]  164.1,26.6 270 top
R50-36  200R  [R0805]  162,26.6 270 top
R50-37  200R  [R0805]  162,26.6 90 bottom
R50-38  200R  [R0805]  164.1,26.6 90 bottom
R50-39  200R  [R0805]  164.1,22.4 90 bottom
R50-40  200R  [R0805]  162,22.4 90 bottom
R50-41  200R  [R0805]  162,32.4 270 top
R50-42  200R  [R0805]  164.1,32.4 270 top
R50-43  200R  [R0805]  164.1,36.6 270 top
R50-44  200R  [R0805]  162,36.6 270 top
R50-45  200R  [R0805]  162,36.6 90 bottom
R50-46  200R  [R0805]  164.1,36.6 90 bottom
R50-47  200R  [R0805]  164.1,32.4 90 bottom
R50-48  200R  [R0805]  162,32.4 90 bottom
R50-49  200R  [R0805]  162,42.4 270 top
R50-50  200R  [R0805]  164.1,42.4 270 top
R50-51  200R  [R0805]  164.1,46.6 270 top
R50-52  200R  [R0805]  162,46.6 270 top
R50-53  200R  [R0805]  162,46.6 90 bottom
R50-54  200R  [R0805]  164.1,46.6 90 bottom
R50-55  200R  [R0805]  164.1,42.4 90 bottom
R50-56  200R  [R0805]  162,42.4 90 bottom
R50-57  200R  [R0805]  162,52.4 270 top
R50-58  200R  [R0805]  164.1,52.4 270 top
R50-59  200R  [R0805]  164.1,56.6 270 top
R50-60  200R  [R0805]  162,56.6 270 top
R50-61  200R  [R0805]  162,56.6 90 bottom
R50-62  200R  [R0805]  164.1,56.6 90 bottom
R50-63  200R  [R0805]  164.1,52.4 90 bottom
R50-64  200R  [R0805]  162,52.4 90 bottom
R50-81  200R  [R0805]  162,62.4 270 top
R50-82  200R  [R0805]  164.1,62.4 270 top
R50-83  200R  [R0805]  164.1,66.6 270 top
R50-84  200R  [R0805]  162,66.6 270 top
R50-85  200R  [R0805]  162,66.6 90 bottom
R50-86  200R  [R0805]  164.1,66.6 90 bottom
R50-87  200R  [R0805]  164.1,62.4 90 bottom
R50-88  200R  [R0805]  162,62.4 90 bottom
R50-89  200R  [R0805]  162,72.4 270 top
R50-90  200R  [R0805]  164.1,72.4 270 top
R50-91  200R  [R0805]  164.1,76.6 270 top
R50-92  200R  [R0805]  162,76.6 270 top
R50-93  200R  [R0805]  162,76.6 90 bottom
R50-94  200R  [R0805]  164.1,76.6 90 bottom
R50-95  200R  [R0805]  164.1,72.4 90 bottom
R50-96  200R  [R0805]  162,72.4 90 bottom
R_SCL  10K  [R0805]  20,27.2 0 top
R_SDA  10K  [R0805]  20,25 0 top
REG  LDL1117S33R  [SOT-223]  10.99,56.46 90 bottom
REG1  LDL1117S33R  [SOT-223]  55.7,4.8 180 top
RG1_1  47k  [R0805]  88.9,7.9 0 top
RG1_3  47k  [R0805]  88.8,1.3 180 bottom
RG1_5  47k  [R0805]  88.9,27.9 0 top
RG1_6  47k  [R0805]  88.8,21.3 180 bottom
RG1_7  47k  [R0805]  88.9,47.9 0 top
RG1_8  47k  [R0805]  88.8,41.3 180 bottom
RG1_11  47k  [R0805]  88.9,67.9 0 top
RG1_12  47k  [R0805]  88.8,61.3 180 bottom
RG2_1  470k  [R0805]  95.4,7.8 0 top
RG2_3  470k  [R0805]  95.2,1.3 180 bottom
RG2_5  470k  [R0805]  95.4,27.8 0 top
RG2_6  470k  [R0805]  95.2,21.3 180 bottom
RG2_7  470k  [R0805]  95.4,47.8 0 top
RG2_8  470k  [R0805]  95.2,41.3 180 bottom
RG2_11  470k  [R0805]  95.4,67.8 0 top
RG2_12  470k  [R0805]  95.2,61.3 180 bottom
RG3_3  47k  [R0805]  88.8,37.8 0 top
RG3_4  47k  [R0805]  88.8,31.9 180 bottom
RG3_5  47k  [R0805]  88.8,17.8 0 top
RG3_6  47k  [R0805]  88.8,11.9 180 bottom
RG3_7  47k  [R0805]  88.8,57.8 0 top
RG3_8  47k  [R0805]  88.8,51.9 180 bottom
RG3_11  47k  [R0805]  88.8,77.8 0 top
RG3_12  47k  [R0805]  88.8,71.9 180 bottom
RG4_3  470k  [R0805]  95.2,37.8 0 top
RG4_4  470k  [R0805]  95.2,31.9 180 bottom
RG4_5  470k  [R0805]  95.2,17.8 0 top
RG4_6  470k  [R0805]  95.2,11.9 180 bottom
RG4_7  470k  [R0805]  95.2,57.8 0 top
RG4_8  470k  [R0805]  95.2,51.9 180 bottom
RG4_11  470k  [R0805]  95.2,77.8 0 top
RG4_12  470k  [R0805]  95.2,71.9 180 bottom
RIN1  1.1M  [R0805]  107.4,2.4 90 top
RIN3  1.1M  [R0805]  107.4,6.6 270 bottom
RIN5  1.1M  [R0805]  107.4,12.4 90 top
RIN6  1.1M  [R0805]  107.4,16.6 270 bottom
RIN9  1.1M  [R0805]  107.4,22.4 90 top
RIN10  1.1M  [R0805]  107.4,26.6 270 bottom
RIN10M1  10M  [R0805]  121.1,2.9 270 top
RIN10M3  10M  [R0805]  121.1,6.1 90 bottom
RIN10M5  10M  [R0805]  121.1,12.9 270 top
RIN10M6  10M  [R0805]  121.1,16.1 90 bottom
RIN10M9  10M  [R0805]  121.1,22.9 270 top
RIN10M10  10M  [R0805]  121.1,26.1 90 bottom
RIN10M11  10M  [R0805]  121.1,32.9 270 top
RIN10M12  10M  [R0805]  121.1,36.1 90 bottom
RIN10M13  10M  [R0805]  121.1,42.9 270 top
RIN10M14  10M  [R0805]  121.1,46.1 90 bottom
RIN10M15  10M  [R0805]  121.1,52.9 270 top
RIN10M16  10M  [R0805]  121.1,56.1 90 bottom
RIN10M21  10M  [R0805]  121.1,62.9 270 top
RIN10M22  10M  [R0805]  121.1,66.1 90 bottom
RIN10M23  10M  [R0805]  121.1,72.9 270 top
RIN10M24  10M  [R0805]  121.1,76.1 90 bottom
RIN11  1.1M  [R0805]  107.4,32.4 90 top
RIN12  1.1M  [R0805]  107.4,36.6 270 bottom
RIN13  1.1M  [R0805]  107.4,42.4 90 top
RIN14  1.1M  [R0805]  107.4,46.6 270 bottom
RIN15  1.1M  [R0805]  107.4,52.4 90 top
RIN16  1.1M  [R0805]  107.4,56.6 270 bottom
RIN21  1.1M  [R0805]  107.4,62.4 90 top
RIN22  1.1M  [R0805]  107.4,66.6 270 bottom
RIN23  1.1M  [R0805]  107.4,72.4 90 top
RIN24  1.1M  [R0805]  107.4,76.6 270 bottom
RINS1  11K  [R0805]  107.4,6.7 270 top
RINS3  11K  [R0805]  107.4,2.3 90 bottom
RINS5  11K  [R0805]  107.4,16.7 270 top
RINS6  11K  [R0805]  107.4,12.3 90 bottom
RINS9  11K  [R0805]  107.4,26.7 270 top
RINS10  11K  [R0805]  107.4,22.3 90 bottom
RINS11  11K  [R0805]  107.4,36.7 270 top
RINS12  11K  [R0805]  107.4,32.3 90 bottom
RINS13  11K  [R0805]  107.4,46.7 270 top
RINS14  11K  [R0805]  107.4,42.3 90 bottom
RINS15  11K  [R0805]  107.4,56.7 270 top
RINS16  11K  [R0805]  107.4,52.3 90 bottom
RINS21  11K  [R0805]  107.4,66.7 270 top
RINS22  11K  [R0805]  107.4,62.3 90 bottom
RINS23  11K  [R0805]  107.4,76.7 270 top
RINS24  11K  [R0805]  107.4,72.3 90 bottom
RJ2  10K  [R0805]  27.33,12.26 0 top
RJ3  10K  [R0805]  27.34,25.3 180 top
RJ4  10K  [R0805]  27.33,16.7 180 top
RJ5  10K  [R0805]  27.36,23.14 180 top
RLED1  560  [R0805]  5.24,22.47 90 top
RLED2  560  [R0805]  7.54,22.48 90 top
RLED3  560  [R0805]  9.74,22.49 90 top
RLED4  560  [R0805]  12,22.5 90 top
ROFFSET1  200  [R0805]  71.3,3.1 270 bottom
ROFFSET2  200  [R0805]  75.7,3.1 270 bottom
ROFFSET3  200  [R0805]  75.6,15.8 90 bottom
ROFFSET4  200  [R0805]  71.2,15.9 90 bottom
ROFFSET9  200  [R0805]  71.3,23.1 270 bottom
ROFFSET10  200  [R0805]  75.7,23.1 270 bottom
ROFFSET11  200  [R0805]  75.6,35.8 90 bottom
ROFFSET12  200  [R0805]  71.2,35.9 90 bottom
ROFFSET13  200  [R0805]  71.3,43.1 270 bottom
ROFFSET14  200  [R0805]  75.7,43.1 270 bottom
ROFFSET15  200  [R0805]  75.6,55.8 90 bottom
ROFFSET16  200  [R0805]  71.2,55.9 90 bottom
ROFFSET21  200  [R0805]  71.3,63.1 270 bottom
ROFFSET22  200  [R0805]  75.7,63.1 270 bottom
ROFFSET23  200  [R0805]  75.6,75.8 90 bottom
ROFFSET24  200  [R0805]  71.2,75.9 90 bottom
RPOW  560  [R0805]  21.9,75.9 90 top
RS6  10K  [R0805]  27.34,14.42 180 top
RS7  10K  [R0805]  27.37,20.98 180 top
RS8  10K  [R0805]  27.36,18.82 180 top
RS9  10K  [R0805]  27.37,27.42 180 top
S1  JS202011SCQN  [JS202011SCQN]  155.1,4.6 0 top
S2  JS202011SCQN  [JS202011SCQN]  114.9,4.5 0 top
S5  JS202011SCQN  [JS202011SCQN]  155.1,4.4 180 bottom
S6  JS202011SCQN  [JS202011SCQN]  114.7,4.5 180 bottom
S9  JS202011SCQN  [JS202011SCQN]  56.4,73 90 top
S10  JS202011SCQN  [JS202011SCQN]  155.1,14.6 0 top
S11  JS202011SCQN  [JS202011SCQN]  114.9,14.5 0 top
S12  JS202011SCQN  [JS202011SCQN]  155.1,14.4 180 bottom
S13  JS202011SCQN  [JS202011SCQN]  114.7,14.5 180 bottom
S18  JS202011SCQN  [JS202011SCQN]  155.1,24.6 0 top
S19  JS202011SCQN  [JS202011SCQN]  114.9,24.5 0 top
S20  JS202011SCQN  [JS202011SCQN]  155.1,24.4 180 bottom
S21  JS202011SCQN  [JS202011SCQN]  114.7,24.5 180 bottom
S22  JS202011SCQN  [JS202011SCQN]  155.1,34.6 0 top
S23  JS202011SCQN  [JS202011SCQN]  114.9,34.5 0 top
S24  JS202011SCQN  [JS202011SCQN]  155.1,34.4 180 bottom
S25  JS202011SCQN  [JS202011SCQN]  114.7,34.5 180 bottom
S26  JS202011SCQN  [JS202011SCQN]  155.1,44.6 0 top
S27  JS202011SCQN  [JS202011SCQN]  114.9,44.5 0 top
S28  JS202011SCQN  [JS202011SCQN]  155.1,44.4 180 bottom
S29  JS202011SCQN  [JS202011SCQN]  114.7,44.5 180 bottom
S30  JS202011SCQN  [JS202011SCQN]  155.1,54.6 0 top
S31  JS202011SCQN  [JS202011SCQN]  114.9,54.5 0 top
S32  JS202011SCQN  [JS202011SCQN]  155.1,54.4 180 bottom
S33  JS202011SCQN  [JS202011SCQN]  114.7,54.5 180 bottom
S42  JS202011SCQN  [JS202011SCQN]  155.1,64.6 0 top
S43  JS202011SCQN  [JS202011SCQN]  114.9,64.5 0 top
S44  JS202011SCQN  [JS202011SCQN]  155.1,64.4 180 bottom
S45  JS202011SCQN  [JS202011SCQN]  114.7,64.5 180 bottom
S46  JS202011SCQN  [JS202011SCQN]  155.1,74.6 0 top
S47  JS202011SCQN  [JS202011SCQN]  114.9,74.5 0 top
S48  JS202011SCQN  [JS202011SCQN]  155.1,74.4 180 bottom
S49  JS202011SCQN  [JS202011SCQN]  114.7,74.5 180 bottom
SW_RESET  MF-SW-TACT-4.2MM  [TACT4.2MM]  18.5,16.8 270 top
U340G  CH340G  [SOIC16]  12.8,65 180 bottom
USB1  MF-CON-MICROUSB-RIGHT  [10118193-0001LF]  1.9,67.6 270 top
X1  LTI-SASF54GT  [LTI-SASF54GT]  132,4.3 90 top
X4  LTI-SASF54GT  [LTI-SASF54GT]  132,14.3 90 top
X5  LTI-SASF54GT  [LTI-SASF54GT]  143,4.3 90 top
X6  LTI-SASF54GT  [LTI-SASF54GT]  143,14.3 90 top
X9  LTI-SASF54GT  [LTI-SASF54GT]  132,24.3 90 top
X10  LTI-SASF54GT  [LTI-SASF54GT]  143,24.3 90 top
X11  LTI-SASF54GT  [LTI-SASF54GT]  132,34.3 90 top
X12  LTI-SASF54GT  [LTI-SASF54GT]  143,34.3 90 top
X13  LTI-SASF54GT  [LTI-SASF54GT]  132,44.3 90 top
X14  LTI-SASF54GT  [LTI-SASF54GT]  143,44.3 90 top
X15  LTI-SASF54GT  [LTI-SASF54GT]  132,54.3 90 top
X16  LTI-SASF54GT  [LTI-SASF54GT]  143,54.3 90 top
X21  LTI-SASF54GT  [LTI-SASF54GT]  132,64.3 90 top
X22  LTI-SASF54GT  [LTI-SASF54GT]  143,64.3 90 top
X23  LTI-SASF54GT  [LTI-SASF54GT]  132,74.3 90 top
X24  LTI-SASF54GT  [LTI-SASF54GT]  143,74.3 90 top
Y1  ABL-12.000MHZ-B2  [HC49US]  12.7,76.3 0 top

## Tracks (layer width: path | path; a pad name or v marks a point on that pad's centre or on a via)
5VINFROMRIGHT
  Top 0.381: S9.3 56.25,75.5 55.25,76.5 45.5,76.5 44.5,75.5 PIN_RIGHT.3
5VINFROMUSB  (via drill 0.3)
  Top 0.381: v29.75,67.75 8,67.75 6.75,69 4.5,69 USB1.1 | v57.75,67.75 57.75,69.25 59,70.5 S9.1
  Route15 0.381: v57.75,67.75 v29.75,67.75
+3V3  (via drill 0.3)
  Top 0.152: LEDPOW.A 24,76.5 30.5,70 30.5,68 | 30.5,66.25 30.5,64.5 31.5,63.5 PIN_AIN_IO2_PWRGND.16 31.75,63.5 34,63.5 PIN_AIN_IO2_PWRGND.14 | 30.5,66.25 30.5,68 | 30.5,68 45,68 46.25,69.25 46.75,69.25 PIN_AIN_IO2_PWRGND.3 47,69.5 51.5,74 60.5,74 60.75,73.75 60.75,62.75 57.75,59.75 57.25,59.75 CV12.1 57,59.75 53.75,59.75 CV11.1 | 32.25,51 FPGA.109 | 34.75,53 FPGA.107 34.7,52.9 34.3,52.9 FPGA.108 | 34.25,53 FPGA.108 | 33,46.75 32.75,47 32.25,47 FPGA.117 | 33,46.75 33,41.25 32.75,41.5 32.25,41.5 FPGA.128 32.2,41.4 29,41.4 | 33,46.75 33,47.75 32.75,48 32.25,48 FPGA.115 | 34.75,31.5 FPGA.2 34.7,31.4 34.3,31.4 FPGA.1 | 34.25,31.5 FPGA.1 | 38,32.25 38.25,32 38.25,31.5 FPGA.9 38.2,31.3 38.2,29 | 41,52 41.25,52.25 41.25,52.75 FPGA.94 | 47,28 47,28.25 45.25,30 45.25,31.25 | 47,28 47,27.25 OSC.4 46.28,26.17 44.17,26.17 41.34,29 38.2,29 | 45.25,31.25 45.25,34.4 49.2,34.4 | 45.25,31.25 FPGA.23 | FPGA.31 49.21,34.4 49.2,34.4 | 50.75,31.5 FPGA.34 50.8,31.4 51.2,31.4 FPGA.35 | 51.25,31.5 FPGA.35 | FPGA.37 53.5,33.25 53.5,33.2 51.8,31.5 FPGA.36 | 51.75,31.5 FPGA.36 | FPGA.51 53.5,40.5 53.2,40.5 53,40.3 53,39.6 53.1,39.5 53.5,39.5 FPGA.49 53.8,39.4 58,39.4 | 51,28 51.25,28.25 51.25,31.25 FPGA.35 | 51,28 50.5,27.5 C_OSC.1 | 51,28 47,28 | FPGA.72 53.75,50.75 53.75,50.5 FPGA.71 53.5,50.5 | FPGA.67 53.5,48.5 53,48.5 52.3,49.2 52.3,52.1 52.35,52.15 | 51.75,52.75 FPGA.73 | 47.25,53 FPGA.82 47.3,53 47.3,57 | 53.5,59.75 CV11.1 | 51.75,53 FPGA.73 | 41.25,53 FPGA.94 | CG15.1 36.75,26.25 34.25,26.25 CG13.1 34,26.25 28.25,26.25 | 28.25,26.25 28.25,27.25 RS9.1 28.5,27.25 30.75,27.25 CG14.1 | 28.25,26.25 28.25,25.5 RJ3.1 28.25,25.25 28.25,24.25
  Top 0.152: 28.25,24.25 28.25,23.25 RJ5.1 28.25,23 28.25,21 RS7.1 28.25,20.75 28.25,19 RS8.1 28.25,18.75 28.25,16.75 RJ4.1 28.5,16.5 44.75,16.5 48.75,12.5 49.25,12.5 PIN_ANALOG_IOEXP.15 | 12.75,53.25 8.5,53.25 7.75,54 | 12.75,53.25 13.75,53.25 IOEXPAND_0X22.9 14,53.25 14.75,53.25 15.25,53.75 15.25,54.75 | 7.75,54 7.25,54.5 6.75,54.5 IOEXPAND_0X22.18 | 7.75,54 7.75,55.25 7.25,55.75 6.75,55.75 IOEXPAND_0X22.16 | 15.25,54.75 15.5,54.5 16.25,54.5 IOEXPAND_0X23.18 16.5,54.5 17,54.5 17.75,53.75 | 15.25,54.75 15.25,55.5 16.25,56.5 IOEXPAND_0X23.15 16.5,56.25 16.5,55.75 IOEXPAND_0X23.16 | 17.75,53.75 18.25,53.25 23.5,53.25 IOEXPAND_0X23.9 | 12.75,44 13,44.25 15.25,44.25 | 12.75,44 10.5,41.75 6.75,41.75 IOEXPAND_0X20.18 | 15.25,44.25 15.75,44.25 16.25,43.75 IOEXPAND_0X21.15 | 21,25 21,27 R_SCL.2 21,27.25 21,40.25 | 15.25,41.5 15.25,41.25 14.5,40.5 14,40.5 IOEXPAND_0X20.9 | 15.25,41.5 15.5,41.75 16.25,41.75 IOEXPAND_0X21.18 16.5,41.75 17.25,41.75 18.75,40.25 21,40.25 | 21,40.25 22.25,40.25 22.5,40.5 23.5,40.5 IOEXPAND_0X21.9 | 21,25 20.25,24.25 | 20.25,24.25 18.75,22.75 18.75,6.75 17.75,5.75 17.75,4.75 JP1.9 | 21,25 R_SDA.2 | 15.25,41.5 15.25,44.25 | 12.75,44 12.75,53.25 | 17.75,53.75 v17.75,53.5 | 20.25,24.25 28.25,24.25 | v11,66.25 30.5,66.25 | CV11.1 50.98,57 47.3,57 | 29,50.9 29,53 33,57 41.2,57 | 29,50.9 29,41.4 | 29,41.4 29,39.09 29.17,38.92 29.17,35.8 | 29.17,35.8 29.17,33.83 32.95,30.05 | 47.3,57 41.2,57 | 32.95,30.05 34,29 38.2,29 | CV11.1 58,55.36 58,50.9 | 58,50.9 58,39.4 | 58,39.4 58,32 | FPGA.109 32.3,51 34.2,52.9 FPGA.108 | FPGA.103 36.7,52.9 36.7,53.4 36.5,53.6 34.9,53.6 34.3,53 FPGA.108
  Top 0.152: 52.35,52.15 53.7,50.8 FPGA.72 | 52.35,52.15 51.8,52.7 FPGA.73 | FPGA.143 32.3,33.8 32.3,33.4 FPGA.144 32.3,33.3 34.2,31.4 FPGA.1 | 29.17,35.8 32.2,35.8 FPGA.139 | 32.95,30.05 34.2,31.3 FPGA.1 | FPGA.36 51.7,31.4 51.3,31.4 FPGA.35 | 49.2,34.4 49.8,35 53.5,35 FPGA.40 | 41.2,57 41.2,53 FPGA.94 | 58,50.9 53.8,50.9 FPGA.72 | 29,50.9 32.2,50.9 FPGA.109
  Bottom 0.152: U340G.4 12.25,67.5 v11,66.25 8.5,63.75 8.5,62.5 U340G.16 8.5,62.25 8.5,60.25 12.25,56.5 | 17.25,53 14,56.25 REG.TER 14,56.5 12.25,56.5 | 17.25,53 18,52.25 CP6O.1 | 12.25,56.5 8,56.5 REG.2 | v17.75,53.5 17.25,53
+5V
  Top 0.381: C5V_1.2 60,18.25 57,18.25 C_5V_10NF1.2 56.75,18.25 56.5,18.5 54.75,18.5 | 54.75,18.5 53.25,18.5 L2.1 53,18.75 51,18.75 41.25,28.5 32.75,28.5 28.75,32.5 28.75,38.75 27.5,40 PIN_IO_1.2 27.25,40.25 27.25,41 24.75,43.5 24.75,59.25 24.62,59.38 | 54.75,18.5 54.75,14.75 44.25,4.25 PIN_LEFT.6 | C_5V_10NF.2 59.25,67 56.25,67 L1.1 56,67 53,67 | 53,67 52.5,67 | 53,67 59,73 S9.2 | 53,67 C5V.2 52.5,67 | 52.5,67 42.75,67 39.25,63.5 PIN_AIN_IO2_PWRGND.10 39,63.5 36.75,63.5 PIN_AIN_IO2_PWRGND.12 36.5,63.25 35.25,62 27.25,62 24.62,59.38 | 24.62,59.38 23.25,58 2,58 PIN_DISPLAY.2
A6  (via drill 0.25)
  Top 0.152: v36.7,30 36.7,31.3 FPGA.6 | v31.5,19.6 31.5,18.3 PIN_ANALOG_IOEXP.2
  Route15 0.152: v36.7,30 36.7,24.8 v31.5,19.6
A7  (via drill 0.25)
  Top 0.152: v37.2,30.4 37.2,31.3 FPGA.7 | v34,20.9 34,18.3 PIN_ANALOG_IOEXP.4
  Route15 0.152: v37.2,30.4 37.2,24.1 v34,20.9
A8  (via drill 0.25)
  Top 0.152: v37.7,30 37.7,31.3 FPGA.8 | v36.5,20.4 36.5,18.3 PIN_ANALOG_IOEXP.6
  Bottom 0.152: v37.7,30 37.7,25.6 36.5,24.4 v36.5,20.4
A10  (via drill 0.25)
  Top 0.152: v38.7,30.4 38.7,31.3 FPGA.10 | v39,19.6 39,18.4 39.1,18.3 PIN_ANALOG_IOEXP.8
  Bottom 0.152: v38.7,30.4 38.7,24.5 39,24.2 v39,19.6
A11  (via drill 0.25)
  Top 0.152: v42.8,28.2 41.7,29.3 40.2,29.3 39.3,30.2 39.3,31.3 FPGA.11 | v42.8,19.7 41.7,18.6 41.7,18.3 PIN_ANALOG_IOEXP.10
  Route15 0.152: v42.8,19.7 v42.8,28.2
A12  (via drill 0.25)
  Top 0.152: v44.7,27 42.1,29.6 40.3,29.6 39.7,30.2 39.7,31.3 FPGA.12 | v44.7,20.1 44.7,18.7 44.3,18.3 PIN_ANALOG_IOEXP.12
  Route15 0.152: v44.7,20.1 v44.7,27
A13  (via drill 0.25)
  Top 0.152: v40.2,30.4 40.2,31.3 FPGA.13 | v43.4,21.8 43.7,21.8 46.7,18.8 46.7,18.3 PIN_ANALOG_IOEXP.14
  Bottom 0.152: v40.2,30.4 40.2,23 41.4,21.8 v43.4,21.8
A14  (via drill 0.25)
  Top 0.152: v40.8,30.4 40.8,31.3 FPGA.14 | v40.7,27.9 40.7,27.6 49.2,19.1 49.2,18.3 PIN_ANALOG_IOEXP.16
  Route15 0.152: v40.8,30.4 40.8,28 v40.7,27.9
AIN1  (via drill 0.25)
  Top 0.152: v35.2,38 35.2,31.4 FPGA.3 | v49.4,62.1 49.4,63.4 PIN_AIN_IO2_PWRGND.2
  Route15 0.152: v35.2,38 51.2,54 51.2,58.9 49.4,60.7 v49.4,62.1
CGAIN1
  Top 0.152: 87.35,4.25 87.9,4.8 CGAIN1_1.2 88,4.8 88,7.9 RG1_1.1 | 87.35,4.25 87.1,4 85.1,4 GSW1.3 | CL1.- 87.4,4.2 87.35,4.25
CGAIN2
  Top 0.152: GSW1.1 85.1,2 86.1,2 87,1.1 92.8,1.1 CH1.- 93.8,2 94.4,2.6 94.4,7.8 RG2_1.1
CGAIN5
  Bottom 0.152: 87.9,4.2 87.35,4.75 | 87.35,4.75 87.1,5 85.1,5 GSW3.3 | CL2.- 87.4,4.8 87.35,4.75 | 87.9,4.2 87.9,1.3 RG1_3.1 | 87.9,4.2 CGAIN1_3.2
CGAIN6  (via drill 0.25)
  Route15 0.152: v92.9,7 v86.6,7
  Bottom 0.152: v86.6,7 85.1,7 GSW3.1 | v92.9,7 CH2.- 93.8,7 94.2,6.6 94.2,1.3 RG2_3.1
CGAIN9
  Top 0.152: 87.9,14.8 87.35,14.25 | 87.35,14.25 87.1,14 85.1,14 GSW5.3 | CL3.- 87.4,14.2 87.35,14.25 | 87.9,14.8 87.9,17.8 RG3_5.1 | 87.9,14.8 CGAIN1_5.2
CGAIN10
  Top 0.152: GSW5.1 85.1,12 86.1,12 87.7,10.4 92.1,10.4 CH3.- 93.8,12 94.2,12.4 94.2,17.8 RG4_5.1
CGAIN11
  Bottom 0.152: 87.9,14.2 87.35,14.75 | 87.35,14.75 87.1,15 85.1,15 GSW6.3 | CL4.- 87.4,14.8 87.35,14.75 | 87.9,14.2 87.9,11.9 RG3_6.1 | 87.9,14.2 CGAIN1_6.2
CGAIN12
  Bottom 0.152: GSW6.1 85.1,17 86.1,17 87,17.9 92.8,17.9 CH4.- 93.8,17 94.2,16.6 94.2,11.9 RG4_6.1
CGAIN17
  Top 0.152: 87.35,24.25 87.9,24.8 CGAIN1_9.2 88,24.8 88,27.9 RG1_5.1 | 87.35,24.25 87.1,24 85.1,24 GSW9.3 | CL5.- 87.4,24.2 87.35,24.25
CGAIN18
  Top 0.152: GSW9.1 85.1,22 86.1,22 87,21.1 92.8,21.1 CH5.- 93.8,22 94.4,22.6 94.4,27.8 RG2_5.1
CGAIN19
  Bottom 0.152: 87.9,24.2 87.35,24.75 | 87.35,24.75 87.1,25 85.1,25 GSW10.3 | CL6.- 87.4,24.8 87.35,24.75 | 87.9,24.2 87.9,21.3 RG1_6.1 | 87.9,24.2 CGAIN1_10.2
CGAIN20
  Bottom 0.152: GSW10.1 85.1,27 86.1,27 87,27.9 87.8,27.9 88.8,26.9 88.8,20.5 89,20.3 93.2,20.3 94.2,21.3 RG2_6.1 93.8,21 93.8,27 CH6.-
CGAIN21
  Top 0.152: 87.9,34.8 87.35,34.25 | 87.35,34.25 87.1,34 85.1,34 GSW11.3 | CL7.- 87.4,34.2 87.35,34.25 | 87.9,34.8 87.9,37.8 RG3_3.1 | 87.9,34.8 CGAIN1_11.2
CGAIN22
  Top 0.152: GSW11.1 85.1,32 86.1,32 87.7,30.4 92.1,30.4 CH7.- 93.8,32 94.2,32.4 94.2,37.8 RG4_3.1
CGAIN23
  Bottom 0.152: 87.9,34.2 87.35,34.75 | 87.35,34.75 87.1,35 85.1,35 GSW12.3 | CL8.- 87.4,34.8 87.35,34.75 | 87.9,34.2 87.9,31.9 RG3_4.1 | 87.9,34.2 CGAIN1_12.2
CGAIN24
  Bottom 0.152: GSW12.1 85.1,37 86.1,37 87,37.9 92.8,37.9 CH8.- 93.8,37 94.2,36.6 94.2,31.9 RG4_4.1
CGAIN25
  Top 0.152: 87.35,44.25 87.9,44.8 CGAIN1_13.2 88,44.8 88,47.9 RG1_7.1 | 87.35,44.25 87.1,44 85.1,44 GSW13.3 | CL9.- 87.4,44.2 87.35,44.25
CGAIN26
  Top 0.152: GSW13.1 85.1,42 86.1,42 87,41.1 92.8,41.1 CH9.- 93.8,42 94.4,42.6 94.4,47.8 RG2_7.1
CGAIN27
  Bottom 0.152: 87.9,44.2 87.35,44.75 | 87.35,44.75 87.1,45 85.1,45 GSW14.3 | CL10.- 87.4,44.8 87.35,44.75 | 87.9,44.2 87.9,41.3 RG1_8.1 | 87.9,44.2 CGAIN1_14.2
CGAIN28
  Bottom 0.152: GSW14.1 85.1,47 86.1,47 87,47.9 87.8,47.9 88.8,46.9 88.8,40.5 89,40.3 93.2,40.3 94.2,41.3 RG2_8.1 93.8,41 93.8,47 CH10.-
CGAIN29
  Top 0.152: 87.9,54.8 87.35,54.25 | 87.35,54.25 87.1,54 85.1,54 GSW15.3 | CL11.- 87.4,54.2 87.35,54.25 | 87.9,54.8 87.9,57.8 RG3_7.1 | 87.9,54.8 CGAIN1_15.2
CGAIN30
  Top 0.152: GSW15.1 85.1,52 86.1,52 87.7,50.4 92.1,50.4 CH11.- 93.8,52 94.2,52.4 94.2,57.8 RG4_7.1
CGAIN31
  Bottom 0.152: 87.9,54.2 87.35,54.75 | 87.35,54.75 87.1,55 85.1,55 GSW16.3 | CL12.- 87.4,54.8 87.35,54.75 | 87.9,54.2 87.9,51.9 RG3_8.1 | 87.9,54.2 CGAIN1_16.2
CGAIN32
  Bottom 0.152: GSW16.1 85.1,57 86.1,57 87,57.9 92.8,57.9 CH12.- 93.8,57 94.2,56.6 94.2,51.9 RG4_8.1
CGAIN41
  Top 0.152: CGAIN1_21.2 87.5,64.8 | 87.5,64.8 86.8,64.8 86,64 85.1,64 GSW21.3 | 87.5,64.8 87.5,62 CL13.- | 87.9,64.8 CGAIN1_21.2 | RG1_11.1 88,67.9 88,64.8 CGAIN1_21.2
CGAIN42
  Top 0.152: GSW21.1 85.1,62 86.1,62 87,61.1 92.8,61.1 CH13.- 93.8,62 94.4,62.6 94.4,67.8 RG2_11.1
CGAIN43  (via drill 0.25)
  Route15 0.152: v87.5,65.8 87.5,64.8 v87,64.3
  Bottom 0.152: 87.15,64.45 87.4,64.2 87.9,64.2 | 87.15,64.45 86.6,65 85.1,65 GSW22.3 | v87.5,65.8 87.5,67 CL14.- | 87.15,64.45 v87,64.3 | 87.9,64.2 87.9,61.3 RG1_12.1 | 87.9,64.2 CGAIN1_22.2
CGAIN44
  Bottom 0.152: GSW22.1 85,66.9 84.8,66.9 84.3,66.4 84.3,63.1 87.1,60.3 93.2,60.3 94.2,61.3 RG2_12.1 93.8,61 93.8,67 CH14.-
CGAIN45
  Top 0.152: 87.9,74.8 87.35,74.25 | 87.35,74.25 87.1,74 85.1,74 GSW23.3 | CL15.- 87.4,74.2 87.35,74.25 | 87.9,74.8 87.9,77.8 RG3_11.1 | 87.9,74.8 CGAIN1_23.2
CGAIN46
  Top 0.152: GSW23.1 85.1,72 86.1,72 87,71.1 92.8,71.1 CH15.- 93.8,72 94.2,72.4 94.2,77.8 RG4_11.1
CGAIN47
  Bottom 0.152: 87.9,74.2 87.35,74.75 | 87.35,74.75 87.1,75 85.1,75 GSW24.3 | CL16.- 87.4,74.8 87.35,74.75 | 87.9,74.2 87.9,71.9 RG3_12.1 | 87.9,74.2 CGAIN1_24.2
CGAIN48
  Bottom 0.152: GSW24.1 85,76.9 84.8,76.9 84.3,76.4 84.3,73.7 87.1,70.9 93.2,70.9 94.2,71.9 RG4_12.1 93.8,71.6 93.8,77 CH16.-
CLKINFROMRIGHT_26  (via drill 0.25)
  Top 0.152: v46.8,32.3 46.8,31.4 FPGA.26
  Route15 0.152: v46.8,32.3 46.8,38.2 52.1,43.5 52.4,43.5 53,44.1 53,47 59.2,53.2 59.3,53.2 60.3,54.2 60.3,65.9 50.9,75.3 PIN_RIGHT.1
CLKOUT_32  (via drill 0.25)
  Top 0.152: v61.5,7 63,7 63.3,6.7 IC1.4 | v64.4,13.6 63.4,13.6 IC2.4 | v49.8,32.3 49.8,31.4 FPGA.32 | v64.4,27.7 63.4,26.7 IC10.4 | v64.4,33.6 63.4,33.6 IC11.4 | v63.4,44 64.3,44 64.9,44.6 64.9,45.4 63.7,46.6 63.4,46.6 IC14.4 | v64.4,53.6 63.4,53.6 IC15.4 | v63.3,64 63.8,64 64.2,64.4 64.2,66.1 63.7,66.6 63.4,66.6 IC22.4 | v62.7,71.1 62.6,71.1 61.7,72 61.7,73.3 62,73.6 63.3,73.6 IC23.4
  Route15 0.152: v64.4,33.6 65.2,34.4 65.2,37.6 63.4,39.4 v63.4,44 63.4,51.1 64.4,52.1 v64.4,53.6 62.1,55.9 62.1,60.5 63.3,61.7 v63.3,64 62.7,64.6 v62.7,71.1 | v64.4,13.6 64.4,15 65.5,16.1 65.5,23 63.9,24.6 63.9,27.2 v64.4,27.7 | v62.5,11.1 v62.5,7.9
  Bottom 0.152: IC3.4 63.3,5.3 62.1,5.3 61.5,5.9 v61.5,7 62.4,7.9 v62.5,7.9 | 63.6,12.2 63.7,12.2 64.4,12.9 v64.4,13.6 | 63.6,12.2 63.4,12.2 IC4.4 63.6,12.2 | v49.8,32.3 63.2,32.3 63.3,32.2 IC9.4 63.3,32.1 63.3,31.8 | 64.2,27.5 63,28.7 63,30.7 63.3,31 63.3,31.8 | 64.2,27.5 64.7,27 64.7,25.7 64.9,25.5 64.9,24.6 64.6,24.3 64.2,24.3 63.9,24.6 63.9,24.7 63.4,25.2 IC12.4 | 64.2,27.5 v64.4,27.7 | v64.4,33.6 64.4,32.9 63.3,31.8 | v63.4,44 63.4,45.2 IC16.4 | v64.4,53.6 64.4,52.9 63.7,52.2 63.4,52.2 IC13.4 | v63.3,64 63.3,65.2 IC24.4 | v62.7,71.1 63.3,71.7 63.3,72.1 IC21.4 | 63.6,12.2 v62.5,11.1
CLKOUT_33  (via drill 0.25)
  Top 0.152: 64.8,7.2 64.8,10.9 64,11.7 63.4,11.7 IC2.6 63.3,11.8 63,11.8 62.3,12.5 v62.3,14 | 64.8,7.2 64.8,5.9 63.7,4.8 63.4,4.8 IC1.6 | 64.8,7.2 v64.5,7.2 | 61.75,69.45 63.3,71 63.3,71.7 IC23.6 | 61.75,69.45 61.7,69.4 61.7,64.7 62,64.4 62.4,64.4 62.7,64.7 63.3,64.7 IC22.6 | v61.8,69.4 61.75,69.45 | IC14.6 63.3,44.7 62.7,44.7 62.5,44.5 62.1,44.5 61.8,44.8 v61.8,49.8 61.8,50.2 63.3,51.7 IC15.6 | v64.4,24.8 63.4,24.8 IC10.6 | v62.7,31.1 63.3,31.7 IC11.6 | v51.2,32.9 50.3,32 50.3,31.4 FPGA.33
  Route15 0.152: 62.7,31.2 62.7,32 v61.6,33.1 | 62.7,31.2 65.5,34 65.5,37.7 64.5,38.7 v64.5,46.5 66,48 66,69.7 64.1,71.6 62.5,71.6 61.8,70.9 v61.8,69.4 | 62.7,31.2 v62.7,31.1 | v65,14.9 65,15.2 65.8,16 65.8,23.4 v64.4,24.8
  Bottom 0.152: v64.5,7.2 63.4,7.2 IC3.6 | v62.3,14 63.3,14 IC4.6 63.4,14.1 64.2,14.1 v65,14.9 | 61.85,69.45 61.8,69.5 61.8,73 62.8,74 63.3,74 IC21.6 | 61.85,69.45 63.3,68 63.3,67.2 IC24.6 | v61.8,69.4 61.85,69.45 | 61.85,49.85 61.8,49.9 61.8,53.4 62.4,54 63.3,54 IC13.6 | 61.85,49.85 63.3,48.4 63.3,47.2 IC16.6 63.4,47.1 63.9,47.1 v64.5,46.5 | v61.8,49.8 61.85,49.85 | v64.4,24.8 64.4,26.4 63.7,27.1 63.4,27.1 IC12.6 63.3,27.2 62.7,27.8 v62.7,31.1 | v51.2,32.9 61.4,32.9 v61.6,33.1 62.5,34 63.3,34 IC9.6
CLKOUTTOLEFT_29  (via drill 0.25)
  Top 0.152: v48.3,30.5 48.3,31.3 FPGA.29
  Route15 0.152: v48.3,30.5 48.3,23.4 52.1,19.6 52.1,17 53,16.1 53,9.8 49.3,6.1 PIN_LEFT.8
CONF  (via drill 0.25)
  Top 0.152: v30,36.3 32.2,36.3 FPGA.138 | v27.4,22 26.4,21 RS7.2
  Route15 0.152: v30,36.3 30,34.2 29.5,33.7 29.5,24.1 v27.4,22
CONFIG_SEL  (via drill 0.25)
  Top 0.152: v31.3,42.3 32.2,42.3 FPGA.126 | v24.7,16.2 26.4,14.5 RS6.2
  Route15 0.152: v32.1,32.8 31.6,32.8 v30.5,31.7
  Bottom 0.152: v31.3,42.3 31.3,41.8 32.1,41 v32.1,32.8 | v30.5,31.7 24.7,25.9 v24.7,16.2
D0A  (via drill 0.25)
  Top 0.152: v52.8,38 53.1,38.3 53.7,38.3 FPGA.47 | v60.9,6.9 62.1,5.7 IC1.5
  Route15 0.152: v52.8,38 52,37.2 52,20.2 v52.6,19.6 | v55.5,16.7 60.9,11.3 v60.9,6.9
  Bottom 0.152: v55.5,16.7 v52.6,19.6
D0B  (via drill 0.25)
  Top 0.152: v55.1,44.4 53.8,44.4 FPGA.59 | v62.3,45 63,45.7 IC14.5
  Route15 0.152: v55.1,44.4 61.7,44.4 v62.3,45
D0C  (via drill 0.25)
  Top 0.152: v48.3,54.3 49.1,55.1 50.5,55.1 51.2,54.4 51.2,52.9 FPGA.74 | v27.4,65.4 22.4,65.4 22.2,65.6 14,65.6 12.2,63.8 12.2,62.3 12.1,62.2 10.1,62.2 8.9,63.4 PIN_DIGITAL_1.1
  Route15 0.152: v48.3,54.3 46.5,54.3 45.5,53.3 41.2,53.3 v40.7,53.8 | v38.7,56.2 37.1,56.2 v36.9,56
  Bottom 0.152: v40.7,53.8 40.7,54.2 v38.7,56.2 | v36.9,56 27.5,65.4 v27.4,65.4
D0D  (via drill 0.25)
  Top 0.152: v45.8,54.3 45.8,52.9 FPGA.85 | v17.8,74.7 16.3,74.7 12.2,70.6 10.1,70.6 8.9,69.4 PIN_DIGITAL_1.2
  Route15 0.152: v45.8,73.6 45.8,75.1 43.8,77.1 26.4,77.1 24,74.7 v17.8,74.7
  Bottom 0.152: v45.8,54.3 45.8,61.8 45.6,62 45.6,73.4 v45.8,73.6
D1A  (via drill 0.25)
  Top 0.152: v54.6,37.9 53.8,37.9 FPGA.46 | v63.9,14.8 64.9,13.8 64.9,13.4 64.2,12.7 IC2.5
  Route15 0.152: v54.6,37.9 54.6,37.5 59.2,32.9 59.2,31.3 63.6,26.9 63.6,22.6 65.2,21 65.2,16.2 63.9,14.9 v63.9,14.8
D1B  (via drill 0.25)
  Top 0.152: v54.7,43.9 53.8,43.9 FPGA.58 | v62.3,52.5 63.1,52.5 63.3,52.7 IC15.5
  Route15 0.152: v54.7,43.9 54.7,44.1 54.6,44.2 54.6,44.8 v62.3,52.5
D1C  (via drill 0.25)
  Top 0.152: v54.6,49.8 53.8,49.8 FPGA.70 | v43.2,60.9 v48.1,60.9 | v30,64.8 29.3,64.8 28.2,65.9 13.8,65.9 11.4,63.5 PIN_DIGITAL_1.3
  Route15 0.152: v43.2,60.9 42.1,60.9 37.8,65.2 30.4,65.2 v30,64.8
  Bottom 0.152: v54.6,49.8 54.6,54.4 v48.1,60.9
D1D  (via drill 0.25)
  Top 0.152: v44.7,50.9 46.2,52.4 46.2,52.8 FPGA.84 | v14.6,70.7 12.7,70.7 11.4,69.4 PIN_DIGITAL_1.4
  Route15 0.152: v22.9,61.4 15.4,68.9 15.4,69.9 v14.6,70.7
  Bottom 0.152: v44.7,50.9 39.6,50.9 38.5,49.8 34.5,49.8 28.8,55.5 28.8,59.8 28.5,60.1 28.5,60.7 27.8,61.4 v22.9,61.4
D2A  (via drill 0.25)
  Top 0.152: v52.8,37.3 53.7,37.3 FPGA.45
  Route15 0.152: v52.8,37.3 52.8,35.2 52.3,34.7 52.3,23.2 60.3,15.2 60.3,12.9 62,11.2 62,6.7 v62.3,6.4
  Bottom 0.152: v62.3,6.4 63.1,6.4 63.3,6.2 IC3.5
D2B  (via drill 0.25)
  Top 0.152: v55.5,43.9 55,43.4 53.8,43.4 FPGA.57
  Bottom 0.152: v55.5,43.9 60.5,43.9 62.8,46.2 IC16.5
D2C  (via drill 0.25)
  Top 0.152: v52.8,49.4 53.7,49.4 FPGA.69 | v14.9,63.5 13.9,63.5 PIN_DIGITAL_1.5
  Route15 0.152: v52.8,49.4 47.3,49.4 v46.8,48.9 | v30.9,52.2 29.2,52.2 27.7,53.7 v26.7,53.7 | v25.3,55.1 23.3,55.1 v14.9,63.5
  Bottom 0.152: v46.8,48.9 37.8,48.9 37.2,49.5 33.6,49.5 v30.9,52.2 | v25.3,55.1 v26.7,53.7
D2D  (via drill 0.25)
  Top 0.152: v46.9,51.5 47.7,52.3 47.7,52.8 FPGA.81 | v14.9,68.9 14.3,68.9 13.9,69.3 PIN_DIGITAL_1.6
  Route15 0.152: v46.9,51.5 39.1,51.5 v38.2,50.6 | v30.1,55.6 28.7,55.6 27.4,56.9 26.2,56.9 14.9,68.2 v14.9,68.9
  Bottom 0.152: v38.2,50.6 35.1,50.6 v30.1,55.6
D3A  (via drill 0.25)
  Top 0.152: v54.6,36.8 53.8,36.8 FPGA.44
  Route15 0.152: v54.6,36.8 58.9,32.5 58.9,30.9 v61.1,28.7 | v61.1,19.3 61.1,18.7 60.9,18.5 60.9,13.9 v61.7,13.1
  Bottom 0.152: v61.1,19.3 v61.1,28.7 | IC4.5 v61.7,13.1
D3B  (via drill 0.25)
  Top 0.152: v54.7,42.9 53.8,42.9 FPGA.56
  Route15 0.152: v54.7,42.9 54.7,43.2 54.2,43.7 54.2,45.3 62.1,53.2 v62.3,53.2
  Bottom 0.152: v62.3,53.2 63.2,53.2 63.3,53.1 IC13.5
D3C  (via drill 0.25)
  Top 0.152: v51.2,49.9 53.2,47.9 53.7,47.9 FPGA.66 | v46.5,57.5 45,57.5 44.8,57.3 28.4,57.3 27.6,56.5 v25.5,56.5 | v18,61.9 16.5,63.4 PIN_DIGITAL_1.7
  Route15 0.152: v25.5,56.5 25.1,56.5 19.7,61.9 v18,61.9
  Bottom 0.152: v51.2,49.9 51.2,52.8 v46.5,57.5
D3D  (via drill 0.25)
  Top 0.152: v48.3,52 48.7,52.4 48.7,52.8 FPGA.79 | v17.7,68.9 16.9,68.9 16.5,69.3 PIN_DIGITAL_1.8
  Route15 0.152: v48.3,52 38.9,52 v38.1,51.2 | v29,60.3 29,62.4 v28.7,62.7 | v17.7,68.9 v19.4,67.2
  Bottom 0.152: v38.1,51.2 36.1,51.2 35.9,51 35.5,51 32.3,54.2 32.3,57.3 29.3,60.3 v29,60.3 | v28.7,62.7 24.2,67.2 v19.4,67.2
D4A  (via drill 0.25)
  Top 0.152: v54.6,36 54.3,36.3 53.8,36.3 FPGA.43 | v62.3,26.4 63,25.7 IC10.5
  Route15 0.152: v54.6,36 54.6,34.4 62.3,26.7 v62.3,26.4
D4B  (via drill 0.25)
  Top 0.152: v52.8,42.4 53.7,42.4 FPGA.55 | v62.2,64.9 63,65.7 IC22.5
  Route15 0.152: v52.8,42.4 53.9,43.5 53.9,46.5 54.9,47.5 56,47.5 61.8,53.3 61.8,64.5 v62.2,64.9
D4C  (via drill 0.25)
  Top 0.152: v47.4,48.8 48.8,47.4 53.7,47.4 FPGA.65 | v20,62.4 19,63.4 PIN_DIGITAL_1.9
  Route15 0.152: v30.9,54.1 29.8,54.1 27.3,56.6 26.1,56.6 20.3,62.4 v20,62.4
  Bottom 0.152: v47.4,48.8 47.4,49 45,51.4 39.7,51.4 38.4,50.1 34.9,50.1 v30.9,54.1
D4D  (via drill 0.25)
  Top 0.152: v48.8,53.8 49.2,53.4 49.2,52.9 FPGA.78 | v20,68.3 19,69.3 PIN_DIGITAL_1.10
  Bottom 0.152: v48.8,53.8 45.5,53.8 45,53.3 37.5,53.3 29.2,61.6 29.2,62.9 23.8,68.3 v20,68.3
D5A
  Top 0.152: FPGA.41 53.8,35.3 54.3,35.3 57.9,31.7 59.2,31.7 60.1,32.6 63.2,32.6 63.3,32.7 IC11.5